# EAGLE design Soda_Popper (EAGLE 9.7.0)
AUTHOR: Hunter M., Kyle V., Ben B.; BOARD_NAME: Popper Board; DOC_NUM: 001; PROJECT_NAME: Soda Popper; REVISION: 0.0.1

## Sheet 1 of 4
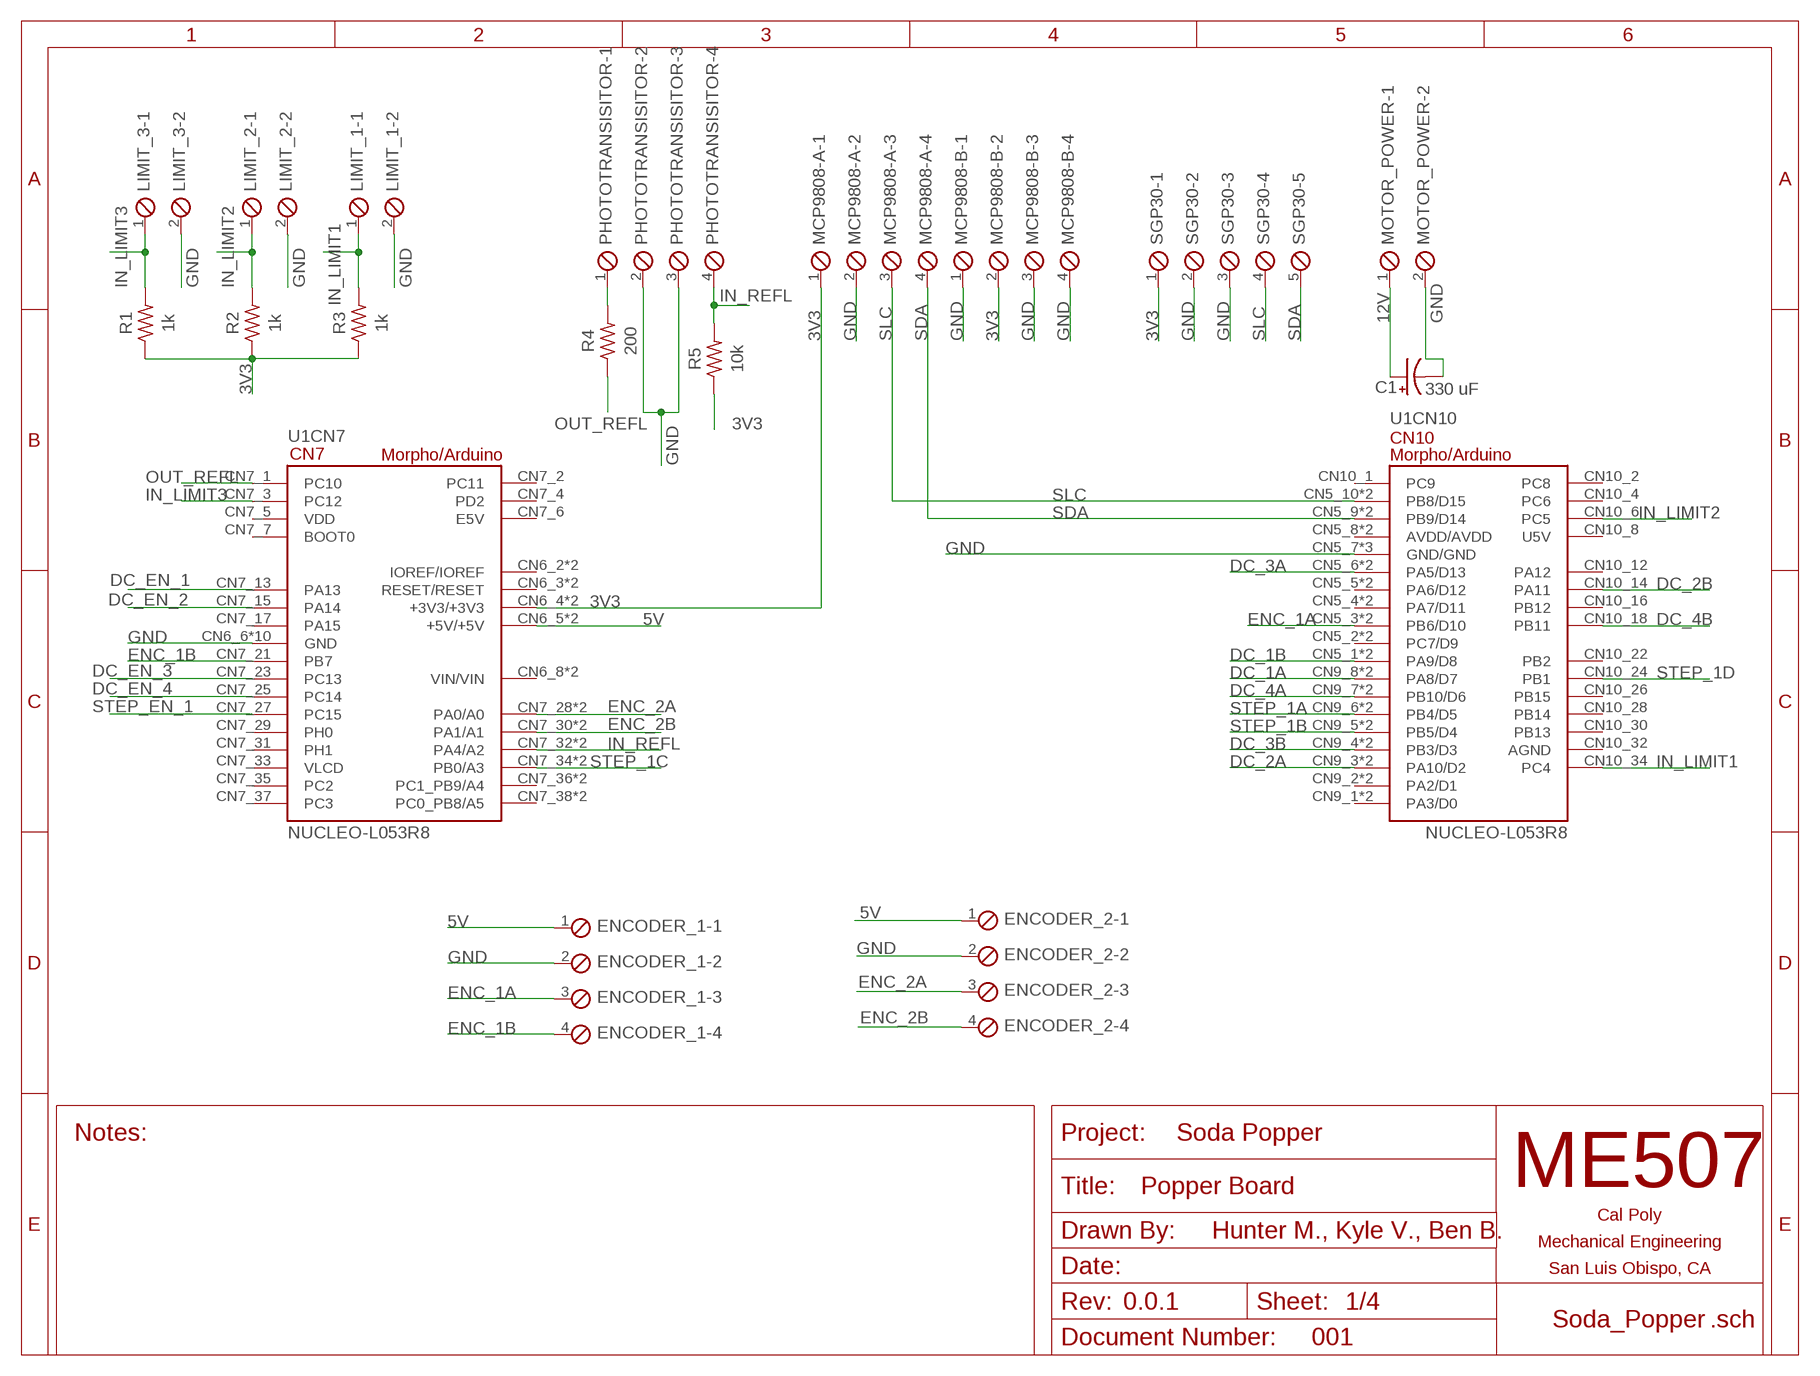
[diagram p0: schematic, sheet 1]

### Parts
C1  330 uF  C-POL-US_RADIAL-11MM-DIA  [CAPPRD508W65D1000H1100B]
ENCODER_1  SCREWTERM_4P_254  [4POL254]
ENCODER_2  SCREWTERM_4P_254  [4POL254]
LIMIT_1  SCREWTERM_2P_254  [2POL254]
LIMIT_2  SCREWTERM_2P_254  [2POL254]
LIMIT_3  SCREWTERM_2P_254  [2POL254]
MCP9808-A  SCREWTERM_4P_254  [4POL254]
MCP9808-B  SCREWTERM_4P_254  [4POL254]
MOTOR_POWER  SCREWTERM_2P_508  [2POL508]
PHOTOTRANSISITOR  SCREWTERM_4P_254  [4POL254]
R1  1k  R-US_CHIP-1206(3216-METRIC)  [RESC3216X70]
R2  1k  R-US_CHIP-1206(3216-METRIC)  [RESC3216X70]
R3  1k  R-US_CHIP-1206(3216-METRIC)  [RESC3216X70]
R4  200  R-US_CHIP-1206(3216-METRIC)  [RESC3216X70]
R5  10k  R-US_CHIP-0805(2012-METRIC)  [RESC2012X65]
SGP30  SCREWTERM_5P_254  [5POL254]
U1  NUCLEO-L053R8  [MODULE_NUCLEO-L053R8]

### Nets
3V3: MCP9808-A.1 MCP9808-B.2 R1.1 R2.1 R3.1 R5.1 SGP30.1 U1.CN6_4(CN7:+3V3/+3V3) U1.CN7_16(CN7:+3V3/+3V3)
5V: ENCODER_1.1 ENCODER_2.1 U1.CN6_5(CN7:+5V/+5V) U1.CN7_18(CN7:+5V/+5V) ; also sheet 2,3,4
12V: C1.1(+) MOTOR_POWER.1 ; also sheet 2,3,4
DC_1A: U1.CN9_8(CN10:PA8/D7) U1.CN10_23(CN10:PA8/D7) ; also sheet 2
DC_1B: U1.CN5_1(CN10:PA9/D8) U1.CN10_21(CN10:PA9/D8) ; also sheet 2
DC_2A: U1.CN9_3(CN10:PA10/D2) U1.CN10_33(CN10:PA10/D2) ; also sheet 2
DC_2B: U1.CN10_14(CN10:PA11) ; also sheet 2
DC_3A: U1.CN5_6(CN10:PA5/D13) U1.CN10_11(CN10:PA5/D13) ; also sheet 3
DC_3B: U1.CN9_4(CN10:PB3/D3) U1.CN10_31(CN10:PB3/D3) ; also sheet 3
DC_4A: U1.CN9_7(CN10:PB10/D6) U1.CN10_25(CN10:PB10/D6) ; also sheet 3
DC_4B: U1.CN10_18(CN10:PB11) ; also sheet 3
DC_EN_1: U1.CN7_13(CN7:PA13) ; also sheet 2
DC_EN_2: U1.CN7_15(CN7:PA14) ; also sheet 2
DC_EN_3: U1.CN7_23(CN7:PC13) ; also sheet 3
DC_EN_4: U1.CN7_25(CN7:PC14) ; also sheet 3
ENC_1A: ENCODER_1.3 U1.CN5_3(CN10:PB6/D10) U1.CN10_17(CN10:PB6/D10)
ENC_1B: ENCODER_1.4 U1.CN7_21(CN7:PB7)
ENC_2A: ENCODER_2.3 U1.CN7_28(CN7:PA0/A0) U1.CN8_1(CN7:PA0/A0)
ENC_2B: ENCODER_2.4 U1.CN7_30(CN7:PA1/A1) U1.CN8_2(CN7:PA1/A1)
GND: C1.2(-) ENCODER_1.2 ENCODER_2.2 LIMIT_1.2 LIMIT_2.2 LIMIT_3.2 MCP9808-A.2 MCP9808-B.1 MCP9808-B.3 MCP9808-B.4 MOTOR_POWER.2 PHOTOTRANSISITOR.2 PHOTOTRANSISITOR.3 SGP30.2 SGP30.3 U1.CN5_7(CN10:GND/GND) U1.CN6_6(CN7:GND) U1.CN6_7(CN7:GND) U1.CN7_8(CN7:GND) U1.CN7_19(CN7:GND) U1.CN7_20(CN7:GND) U1.CN7_22(CN7:GND) U1.CN10_9(CN10:GND/GND) U1.CN10_20(CN10:GND/GND) U1.CN11_1(CN7:GND) U1.CN11_2(CN7:GND) U1.CN12_1(CN7:GND) U1.CN12_2(CN7:GND) ; also sheet 2,3,4
IN_LIMIT1: LIMIT_1.1 R3.2 U1.CN10_34(CN10:PC4)
IN_LIMIT2: LIMIT_2.1 R2.2 U1.CN10_6(CN10:PC5)
IN_LIMIT3: LIMIT_3.1 R1.2 U1.CN7_3(CN7:PC12)
IN_REFL: PHOTOTRANSISITOR.4 R5.2 U1.CN7_32(CN7:PA4/A2) U1.CN8_3(CN7:PA4/A2)
N$1: PHOTOTRANSISITOR.1 R4.2
OUT_REFL: R4.1 U1.CN7_1(CN7:PC10)
SDA: MCP9808-A.4 SGP30.5 U1.CN5_9(CN10:PB9/D14) U1.CN10_5(CN10:PB9/D14)
SLC: MCP9808-A.3 SGP30.4 U1.CN5_10(CN10:PB8/D15) U1.CN10_3(CN10:PB8/D15)
STEP_1A: U1.CN9_6(CN10:PB4/D5) U1.CN10_27(CN10:PB4/D5) ; also sheet 4
STEP_1B: U1.CN9_5(CN10:PB5/D4) U1.CN10_29(CN10:PB5/D4) ; also sheet 4
STEP_1C: U1.CN7_34(CN7:PB0/A3) U1.CN8_4(CN7:PB0/A3) ; also sheet 4
STEP_1D: U1.CN10_24(CN10:PB1) ; also sheet 4
STEP_EN_1: U1.CN7_27(CN7:PC15) ; also sheet 4
Unconnected: U1.CN5_2(CN10:PC7/D9) U1.CN5_4(CN10:PA7/D11) U1.CN5_5(CN10:PA6/D12) U1.CN5_8(CN10:AVDD/AVDD) U1.CN6_2(CN7:IOREF/IOREF) U1.CN6_3(CN7:RESET/RESET) U1.CN6_8(CN7:VIN/VIN) U1.CN7_2(CN7:PC11) U1.CN7_4(CN7:PD2) U1.CN7_5(CN7:VDD) U1.CN7_6(CN7:E5V) U1.CN7_7(CN7:BOOT0) U1.CN7_12(CN7:IOREF/IOREF) U1.CN7_14(CN7:RESET/RESET) U1.CN7_17(CN7:PA15) U1.CN7_24(CN7:VIN/VIN) U1.CN7_29(CN7:PH0) U1.CN7_31(CN7:PH1) U1.CN7_33(CN7:VLCD) U1.CN7_35(CN7:PC2) U1.CN7_36(CN7:PC1_PB9/A4) U1.CN7_37(CN7:PC3) U1.CN7_38(CN7:PC0_PB8/A5) U1.CN8_5(CN7:PC1_PB9/A4) U1.CN8_6(CN7:PC0_PB8/A5) U1.CN9_1(CN10:PA3/D0) U1.CN9_2(CN10:PA2/D1) U1.CN10_1(CN10:PC9) U1.CN10_2(CN10:PC8) U1.CN10_4(CN10:PC6) U1.CN10_7(CN10:AVDD/AVDD) U1.CN10_8(CN10:U5V) U1.CN10_12(CN10:PA12) U1.CN10_13(CN10:PA6/D12) U1.CN10_15(CN10:PA7/D11) U1.CN10_16(CN10:PB12) U1.CN10_19(CN10:PC7/D9) U1.CN10_22(CN10:PB2) U1.CN10_26(CN10:PB15) U1.CN10_28(CN10:PB14) U1.CN10_30(CN10:PB13) U1.CN10_32(CN10:AGND) U1.CN10_35(CN10:PA2/D1) U1.CN10_37(CN10:PA3/D0)

## Sheet 2 of 4
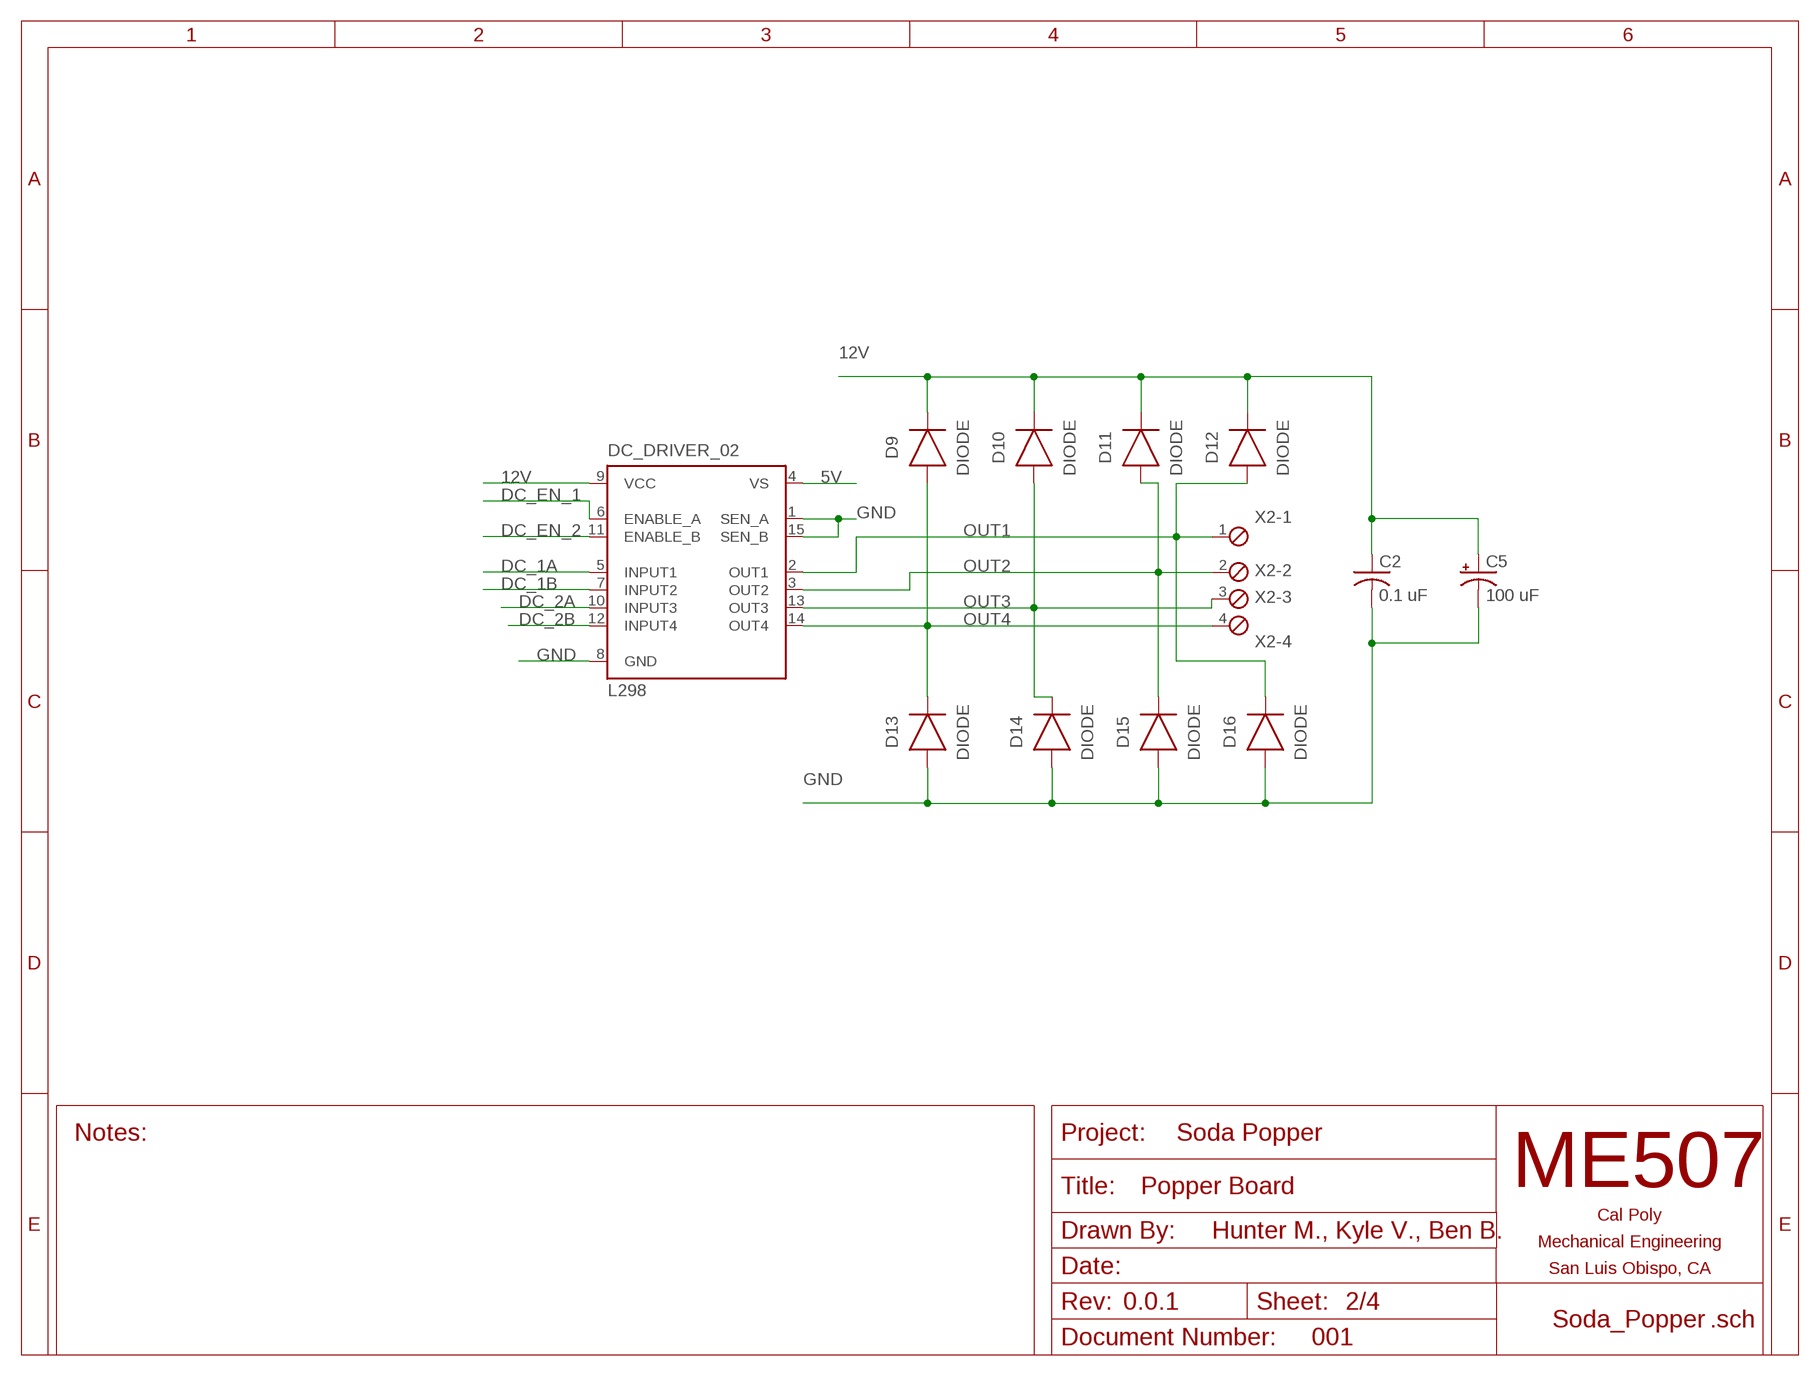
[diagram p1: schematic, sheet 2]

### Parts
C2  0.1 uF  C-US_CHIP-0805(2012-METRIC)  [CAPC2012X110]
C5  100 uF  C-POL-US_RADIAL-11MM-DIA  [CAPPRD508W65D1000H1100B]
D9  DIODE  DIODEDO-214AA(SMB)  [DIOM5336X265N]
D10  DIODE  DIODEDO-214AA(SMB)  [DIOM5336X265N]
D11  DIODE  DIODEDO-214AA(SMB)  [DIOM5336X265N]
D12  DIODE  DIODEDO-214AA(SMB)  [DIOM5336X265N]
D13  DIODE  DIODEDO-214AA(SMB)  [DIOM5336X265N]
D14  DIODE  DIODEDO-214AA(SMB)  [DIOM5336X265N]
D15  DIODE  DIODEDO-214AA(SMB)  [DIOM5336X265N]
D16  DIODE  DIODEDO-214AA(SMB)  [DIOM5336X265N]
DC_DRIVER_02  L298  [MULTIWATT-15]
X2  SCREWTERM_4P_508  [4POL508]

### Nets
5V: DC_DRIVER_02.4(VS) ; also sheet 1,3,4
12V: C2.1 C5.1(+) D9.1(C) D10.1(C) D11.1(C) D12.1(C) DC_DRIVER_02.9(VCC) ; also sheet 1,3,4
DC_1A: DC_DRIVER_02.5(INPUT1) ; also sheet 1
DC_1B: DC_DRIVER_02.7(INPUT2) ; also sheet 1
DC_2A: DC_DRIVER_02.10(INPUT3) ; also sheet 1
DC_2B: DC_DRIVER_02.12(INPUT4) ; also sheet 1
DC_EN_1: DC_DRIVER_02.6(ENABLE_A) ; also sheet 1
DC_EN_2: DC_DRIVER_02.11(ENABLE_B) ; also sheet 1
GND: C2.2 C5.2(-) D13.2(A) D14.2(A) D15.2(A) D16.2(A) DC_DRIVER_02.1(SEN_A) DC_DRIVER_02.8(GND) DC_DRIVER_02.15(SEN_B) ; also sheet 1,3,4
OUT1: D12.2(A) D16.1(C) DC_DRIVER_02.2(OUT1) X2.1
OUT2: D11.2(A) D15.1(C) DC_DRIVER_02.3(OUT2) X2.2
OUT3: D10.2(A) D14.1(C) DC_DRIVER_02.13(OUT3) X2.3
OUT4: D9.2(A) D13.1(C) DC_DRIVER_02.14(OUT4) X2.4

## Sheet 3 of 4
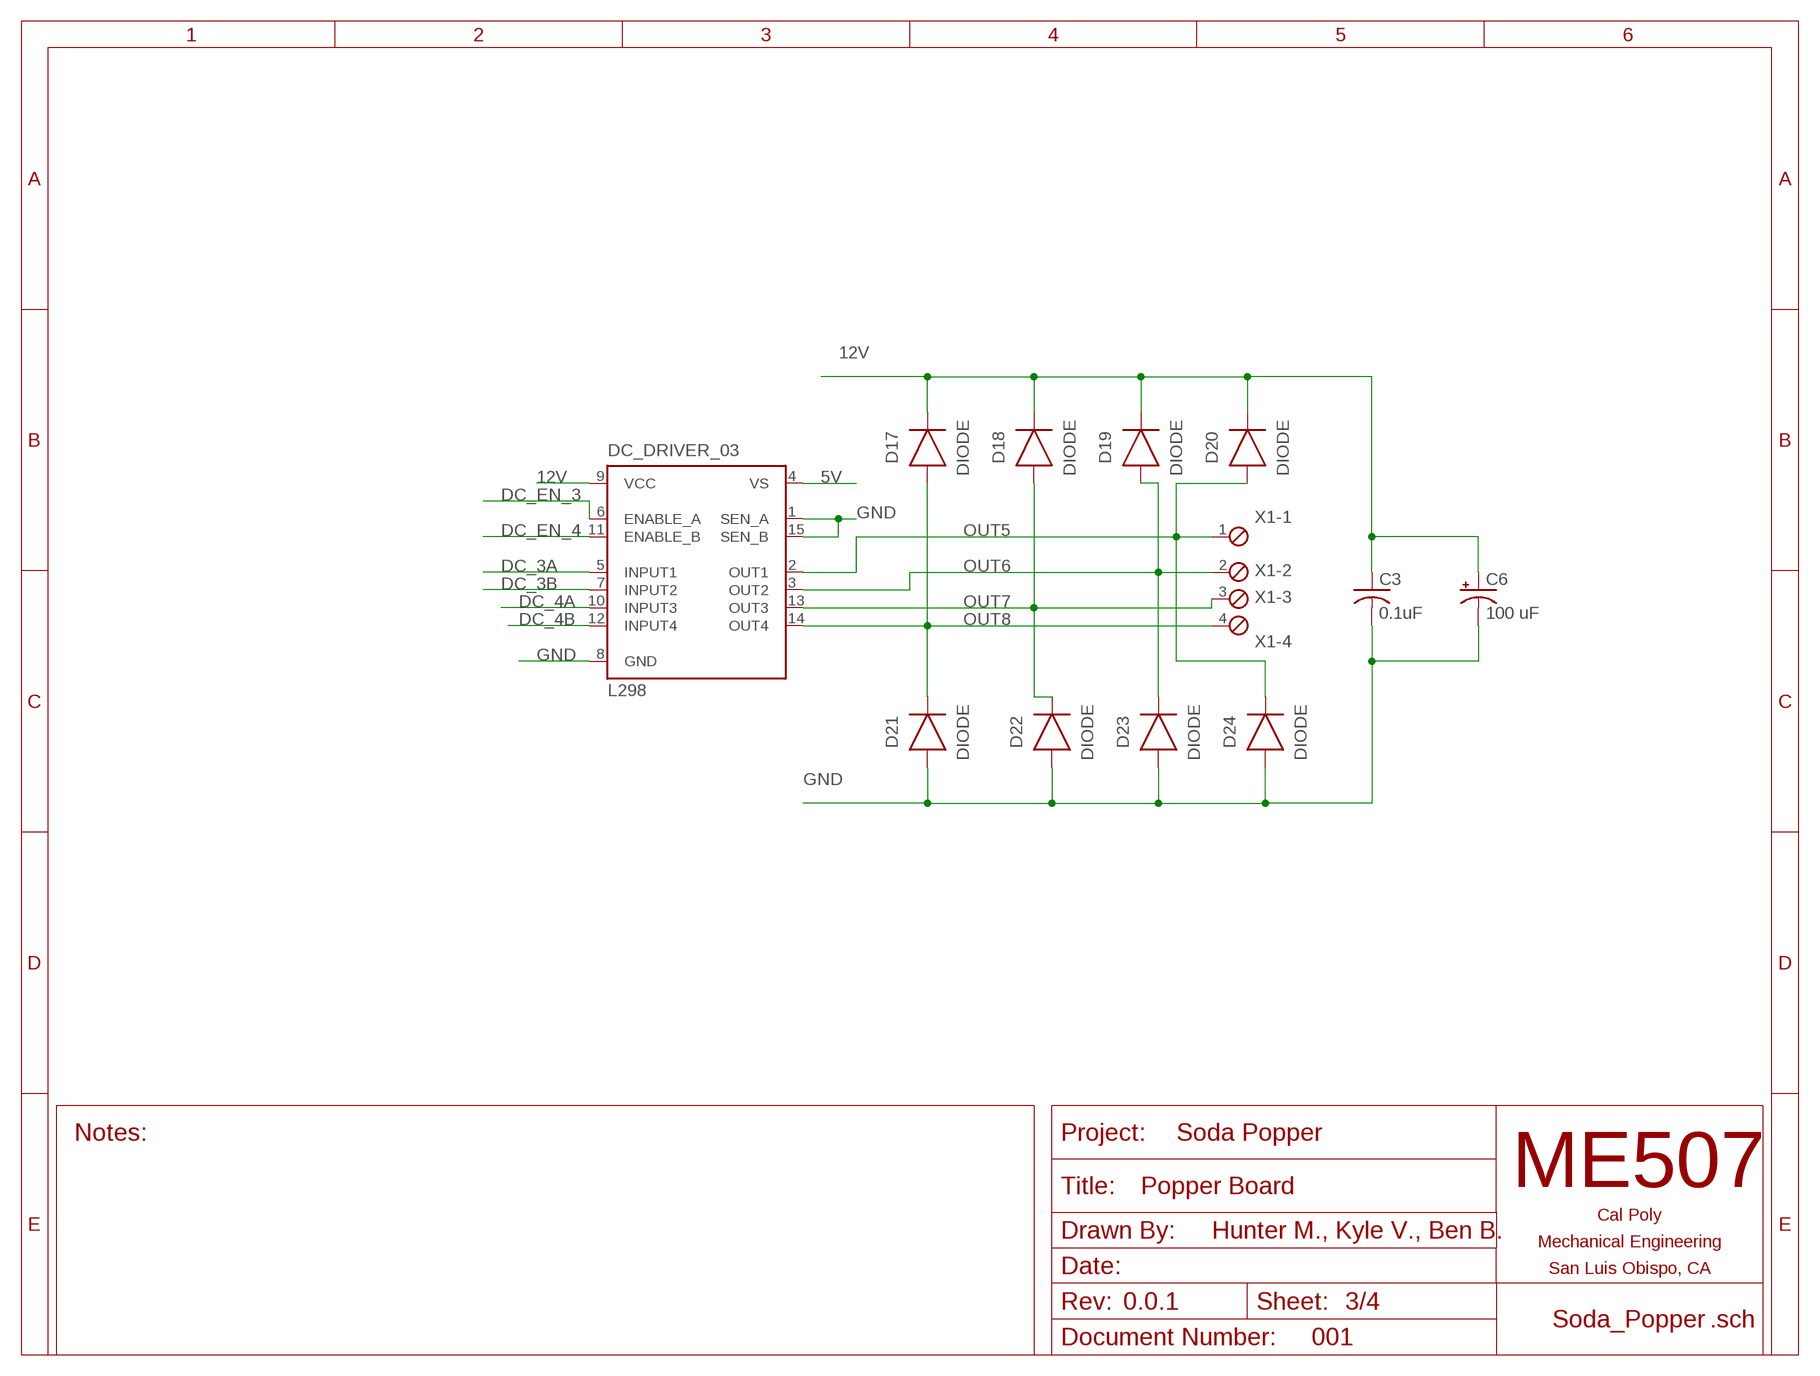
[diagram p2: schematic, sheet 3]

### Parts
C3  0.1uF  C-US_CHIP-0805(2012-METRIC)  [CAPC2012X110]
C6  100 uF  C-POL-US_RADIAL-11MM-DIA  [CAPPRD508W65D1000H1100B]
D17  DIODE  DIODEDO-214AA(SMB)  [DIOM5336X265N]
D18  DIODE  DIODEDO-214AA(SMB)  [DIOM5336X265N]
D19  DIODE  DIODEDO-214AA(SMB)  [DIOM5336X265N]
D20  DIODE  DIODEDO-214AA(SMB)  [DIOM5336X265N]
D21  DIODE  DIODEDO-214AA(SMB)  [DIOM5336X265N]
D22  DIODE  DIODEDO-214AA(SMB)  [DIOM5336X265N]
D23  DIODE  DIODEDO-214AA(SMB)  [DIOM5336X265N]
D24  DIODE  DIODEDO-214AA(SMB)  [DIOM5336X265N]
DC_DRIVER_03  L298  [MULTIWATT-15]
X1  SCREWTERM_4P_508  [4POL508]

### Nets
5V: DC_DRIVER_03.4(VS) ; also sheet 1,2,4
12V: C3.1 C6.1(+) D17.1(C) D18.1(C) D19.1(C) D20.1(C) DC_DRIVER_03.9(VCC) ; also sheet 1,2,4
DC_3A: DC_DRIVER_03.5(INPUT1) ; also sheet 1
DC_3B: DC_DRIVER_03.7(INPUT2) ; also sheet 1
DC_4A: DC_DRIVER_03.10(INPUT3) ; also sheet 1
DC_4B: DC_DRIVER_03.12(INPUT4) ; also sheet 1
DC_EN_3: DC_DRIVER_03.6(ENABLE_A) ; also sheet 1
DC_EN_4: DC_DRIVER_03.11(ENABLE_B) ; also sheet 1
GND: C3.2 C6.2(-) D21.2(A) D22.2(A) D23.2(A) D24.2(A) DC_DRIVER_03.1(SEN_A) DC_DRIVER_03.8(GND) DC_DRIVER_03.15(SEN_B) ; also sheet 1,2,4
OUT5: D20.2(A) D24.1(C) DC_DRIVER_03.2(OUT1) X1.1
OUT6: D19.2(A) D23.1(C) DC_DRIVER_03.3(OUT2) X1.2
OUT7: D18.2(A) D22.1(C) DC_DRIVER_03.13(OUT3) X1.3
OUT8: D17.2(A) D21.1(C) DC_DRIVER_03.14(OUT4) X1.4

## Sheet 4 of 4
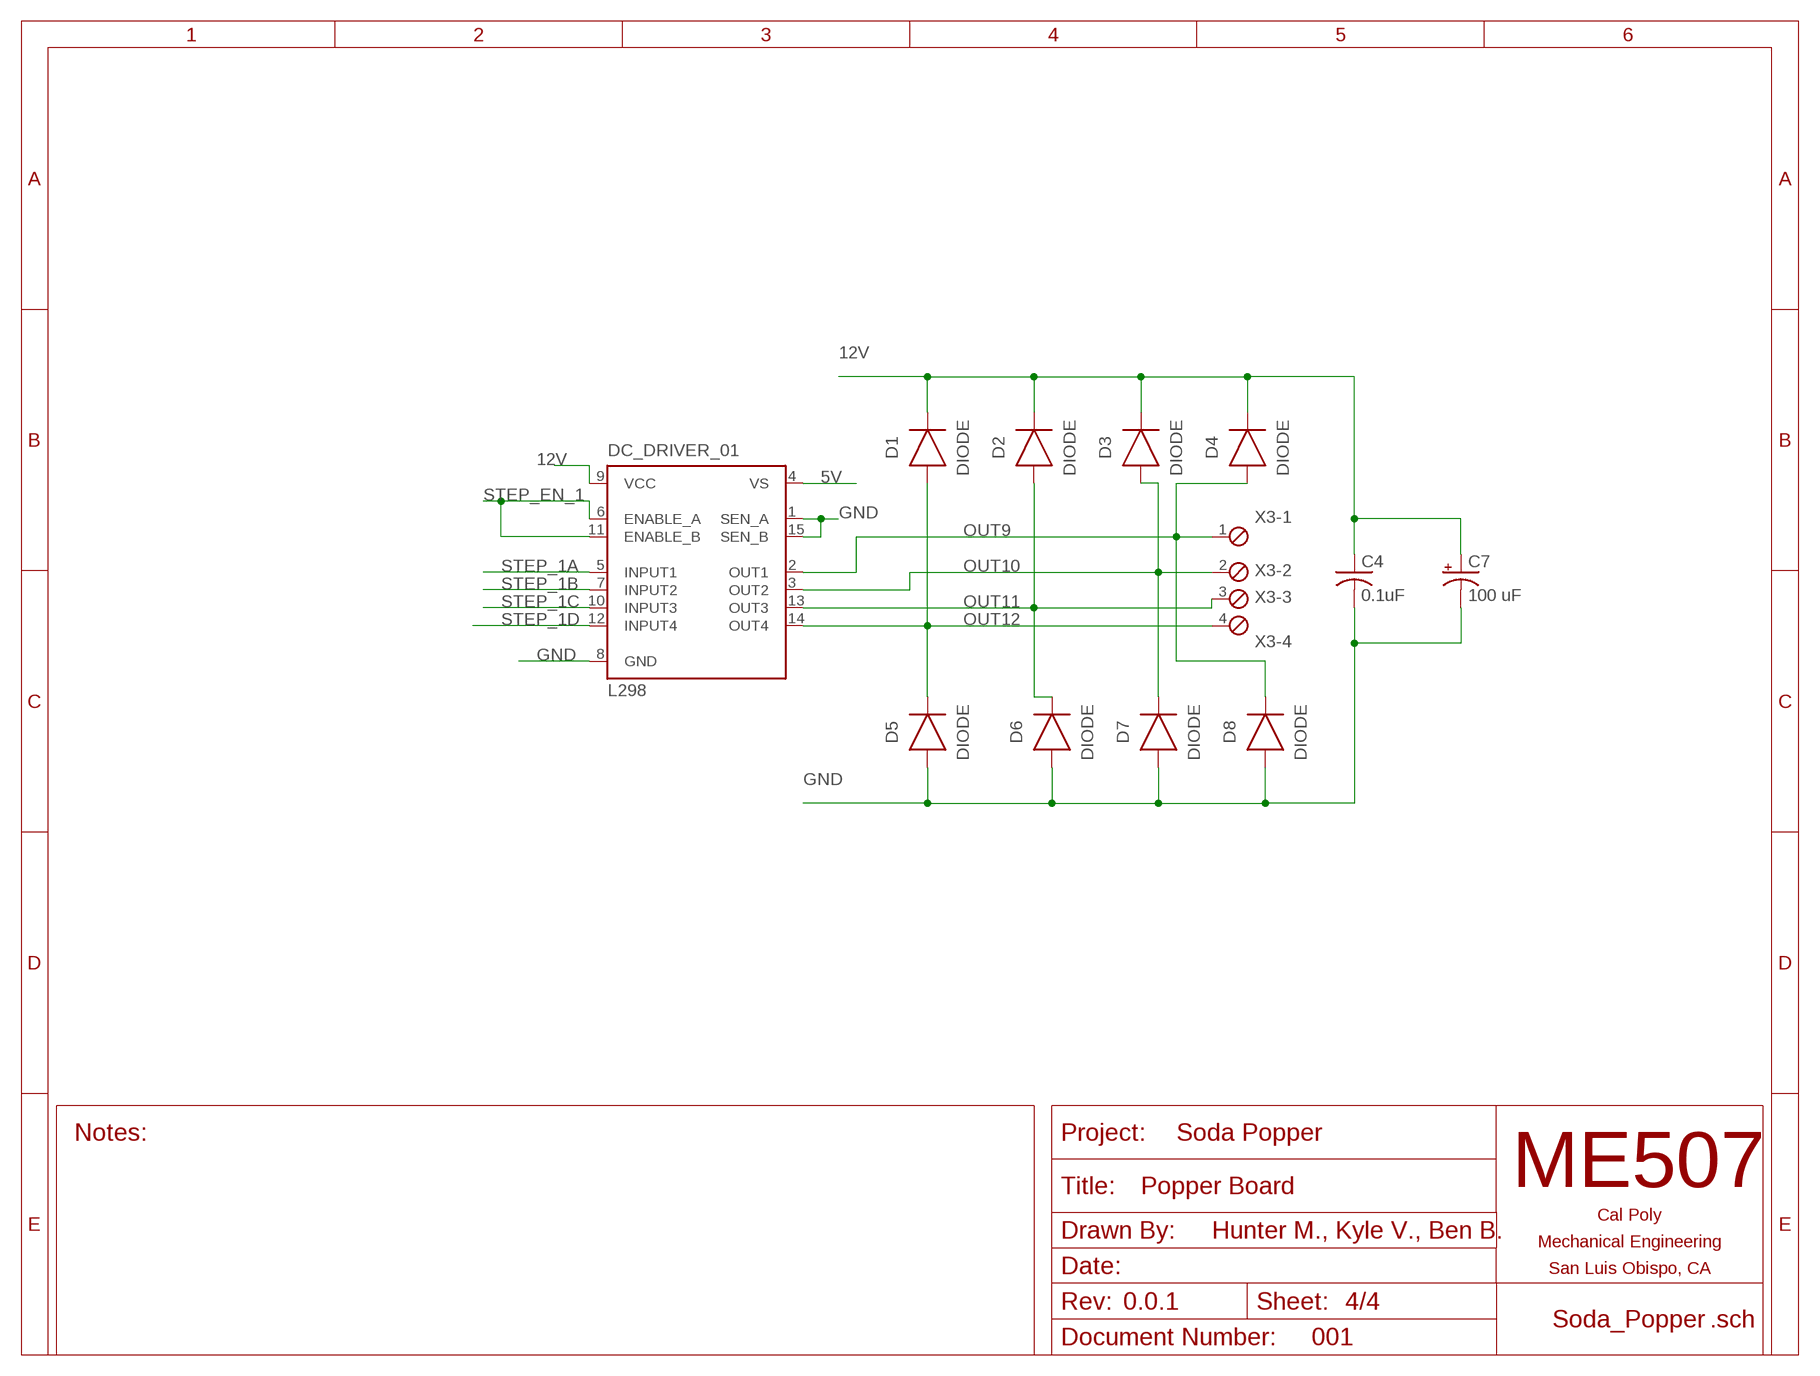
[diagram p3: schematic, sheet 4]

### Parts
C4  0.1uF  C-US_CHIP-0805(2012-METRIC)  [CAPC2012X110]
C7  100 uF  C-POL-US_RADIAL-11MM-DIA  [CAPPRD508W65D1000H1100B]
D1  DIODE  DIODEDO-214AA(SMB)  [DIOM5336X265N]
D2  DIODE  DIODEDO-214AA(SMB)  [DIOM5336X265N]
D3  DIODE  DIODEDO-214AA(SMB)  [DIOM5336X265N]
D4  DIODE  DIODEDO-214AA(SMB)  [DIOM5336X265N]
D5  DIODE  DIODEDO-214AA(SMB)  [DIOM5336X265N]
D6  DIODE  DIODEDO-214AA(SMB)  [DIOM5336X265N]
D7  DIODE  DIODEDO-214AA(SMB)  [DIOM5336X265N]
D8  DIODE  DIODEDO-214AA(SMB)  [DIOM5336X265N]
DC_DRIVER_01  L298  [MULTIWATT-15]
X3  SCREWTERM_4P_508  [4POL508]

### Nets
5V: DC_DRIVER_01.4(VS) ; also sheet 1,2,3
12V: C4.1 C7.1(+) D1.1(C) D2.1(C) D3.1(C) D4.1(C) DC_DRIVER_01.9(VCC) ; also sheet 1,2,3
GND: C4.2 C7.2(-) D5.2(A) D6.2(A) D7.2(A) D8.2(A) DC_DRIVER_01.1(SEN_A) DC_DRIVER_01.8(GND) DC_DRIVER_01.15(SEN_B) ; also sheet 1,2,3
OUT9: D4.2(A) D8.1(C) DC_DRIVER_01.2(OUT1) X3.1
OUT10: D3.2(A) D7.1(C) DC_DRIVER_01.3(OUT2) X3.2
OUT11: D2.2(A) D6.1(C) DC_DRIVER_01.13(OUT3) X3.3
OUT12: D1.2(A) D5.1(C) DC_DRIVER_01.14(OUT4) X3.4
STEP_1A: DC_DRIVER_01.5(INPUT1) ; also sheet 1
STEP_1B: DC_DRIVER_01.7(INPUT2) ; also sheet 1
STEP_1C: DC_DRIVER_01.10(INPUT3) ; also sheet 1
STEP_1D: DC_DRIVER_01.12(INPUT4) ; also sheet 1
STEP_EN_1: DC_DRIVER_01.6(ENABLE_A) DC_DRIVER_01.11(ENABLE_B) ; also sheet 1

## Library data of the parts
C1 C5-C7 = Capacitor:C-POL-US: Capacitor Polarised - ANSI; CATEGORY: Capacitor
C2-C4 = Capacitor:C-US: Capacitor - ANSI; CATEGORY: Capacitor
D1-D24 = Diode:DIODE: Diode Rectifier - Generic; CATEGORY: Diode; SUB-CATEGORY: Rectifier
DC_DRIVER_01-DC_DRIVER_03 = st-microelectronics:L298: DUAL FULL-BRIDGE DRIVER; MPN: L298N; OC_FARNELL: 1589425; OC_NEWARK: 32M1527
ENCODER_1 ENCODER_2 MCP9808-A MCP9808-B PHOTOTRANSISITOR X1-X3 = ME507:SCREWTERM_4P: Screw Terminal Block This part is designed for a screw terminal connector. The 2.54mm (0.100 inch) foorprint can also be used for male or female pin headers such as those on most development boards. One can also solder wires directly into the holes, though this makes modifications or repairs to the system more inconvenient. Larger versions can carry more current.
LIMIT_1-LIMIT_3 MOTOR_POWER = ME507:SCREWTERM_2P: Screw Terminal Block This part is designed for a screw terminal connector. The 2.54mm (0.100 inch) foorprint can also be used for male or female pin headers such as those on most development boards. One can also solder wires directly into the holes, though this makes modifications or repairs to the system more inconvenient. Larger versions can carry more current.
R1-R5 = Resistor:R-US: Resistor Fixed - ANSI; CATEGORY: Resistor; SUB-CATEGORY: Fixed
SGP30 = ME507:SCREWTERM_5P: Screw Terminal Block This part is designed for a screw terminal connector. The 2.54mm (0.100 inch) foorprint can also be used for male or female pin headers such as those on most development boards. One can also solder wires directly into the holes, though this makes modifications or repairs to the system more inconvenient. Larger versions can carry more current.
U1 = NUCLEO-L053R8:NUCLEO-L053R8: STM32 Nucleo-64 development board with STM32L053R8T6 MCU, supports Arduino and ST morpho connectivity Check prices <https://pricing.snapeda.com/parts/NUCLEO-L053R8/STMicroelectronics/view-part?ref=eda>; AVAILABILITY: In Stock; DESCRIPTION: STM32L053R8, mbed-Enabled Development Nucleo-64 STM32L0 ARM® Cortex®-M0+ MCU 32-Bit Embedded Evaluation Board; MF: STMicroelectronics; MP: NUCLEO-L053R8; PACKAGE: None; PRICE: None; PURCHASE-URL: https://pricing.snapeda.com/search/part/NUCLEO-L053R8/?ref=eda

## Board
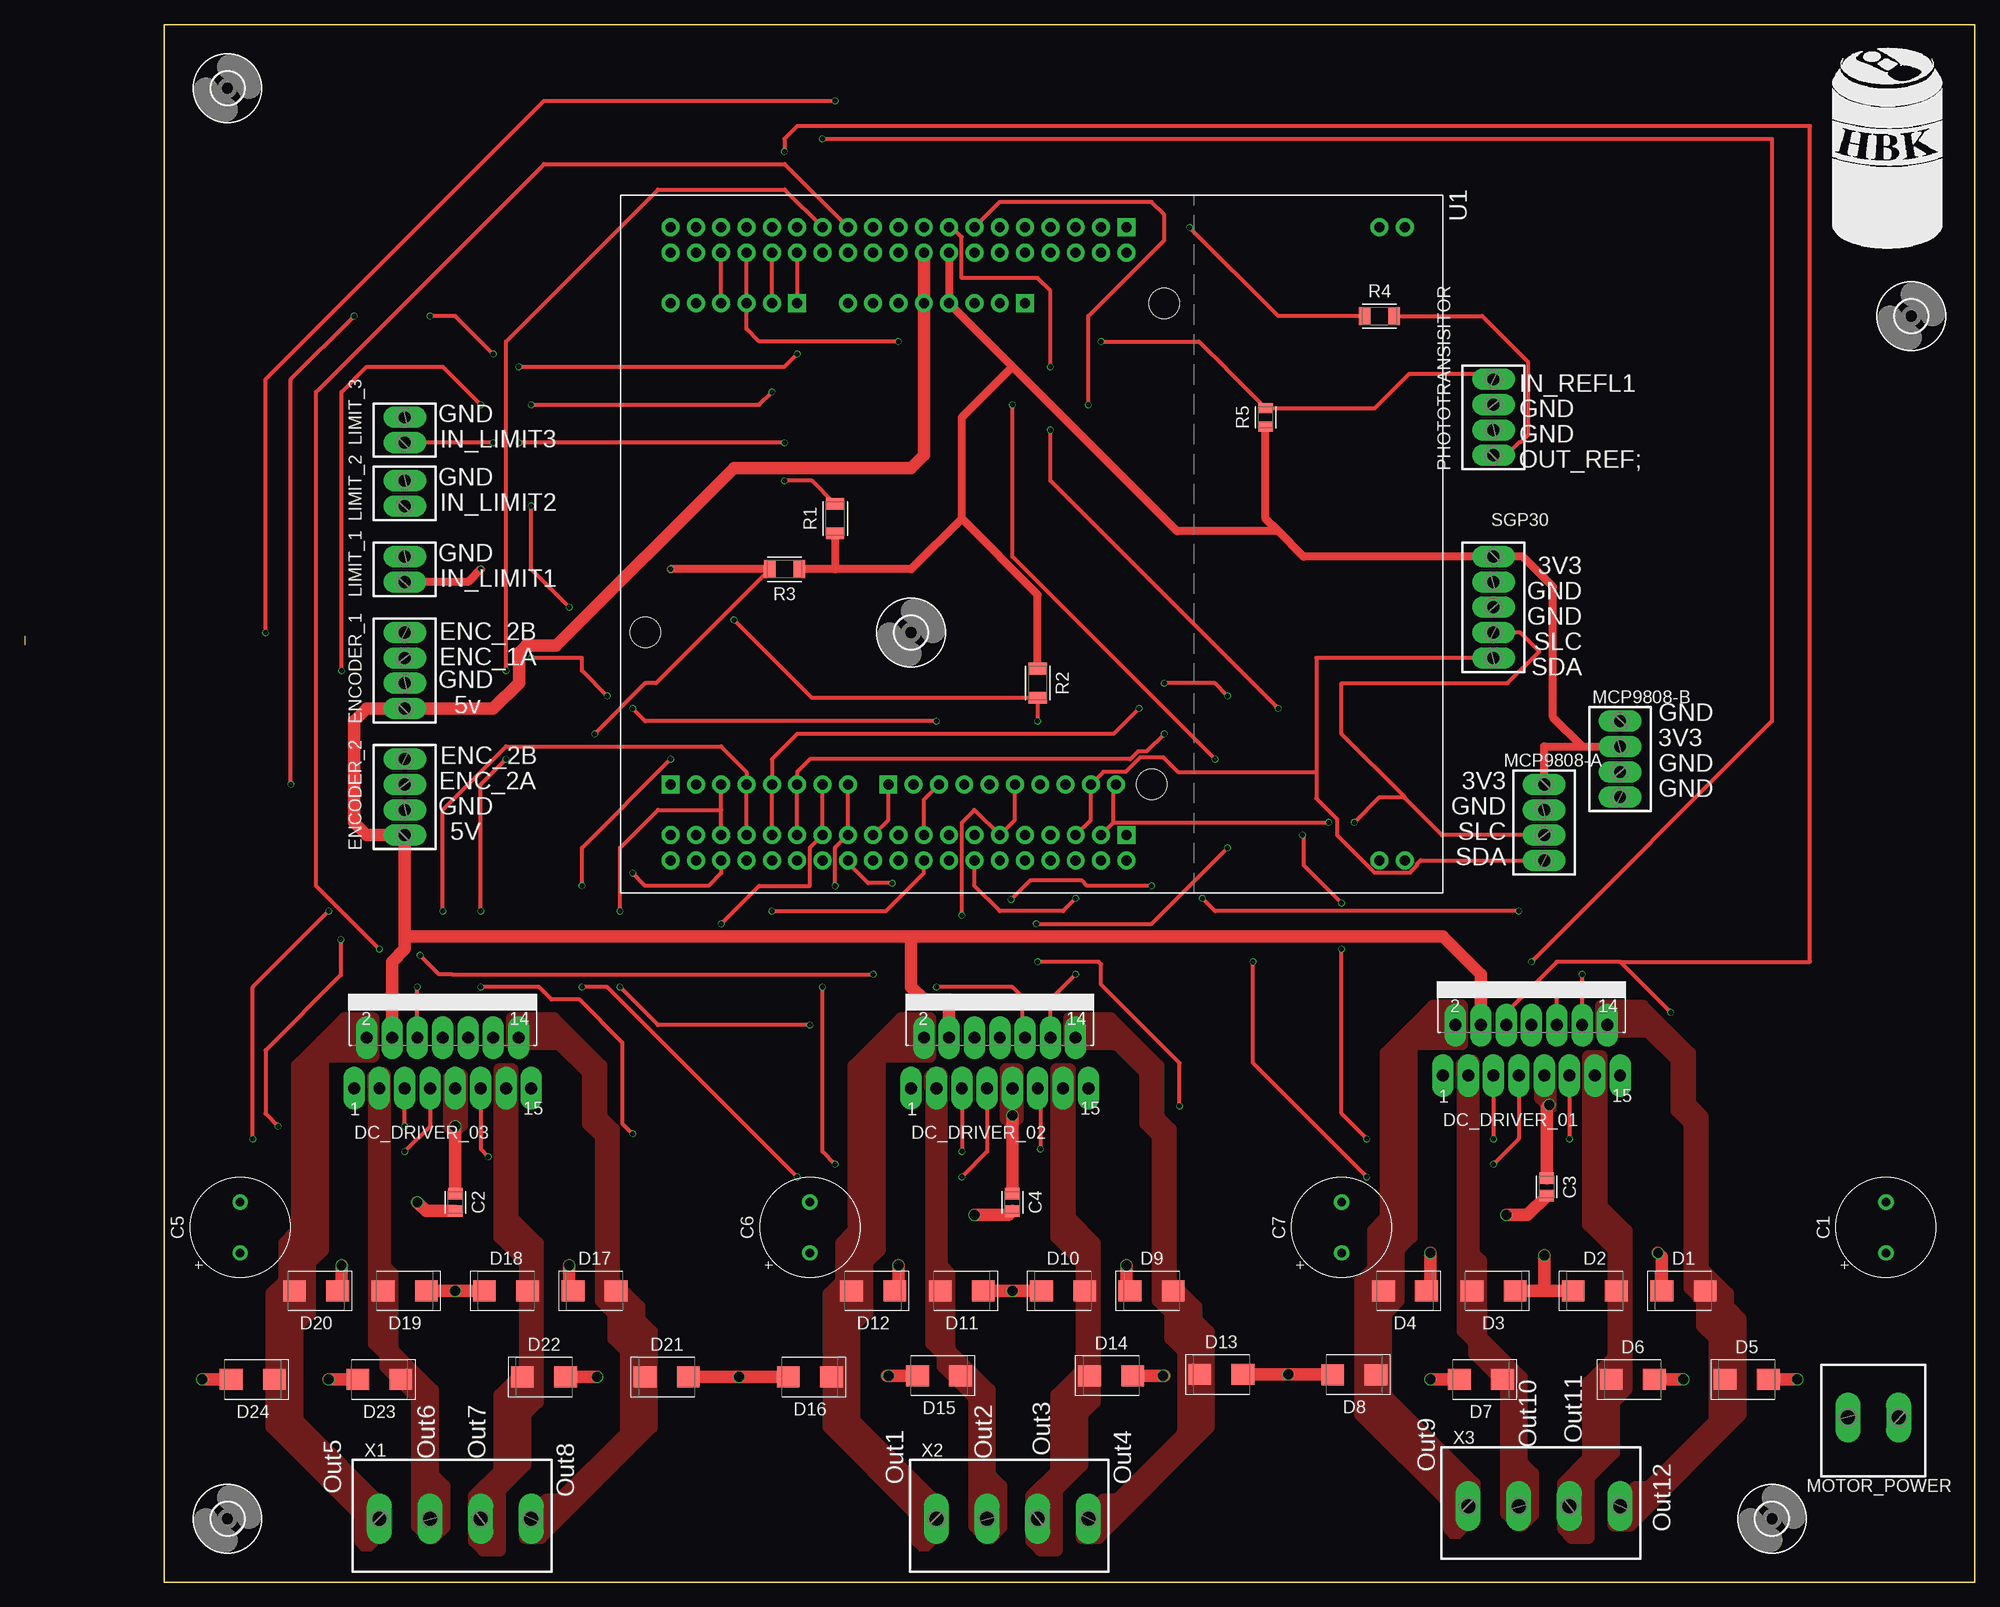
[diagram p4: board, top side]
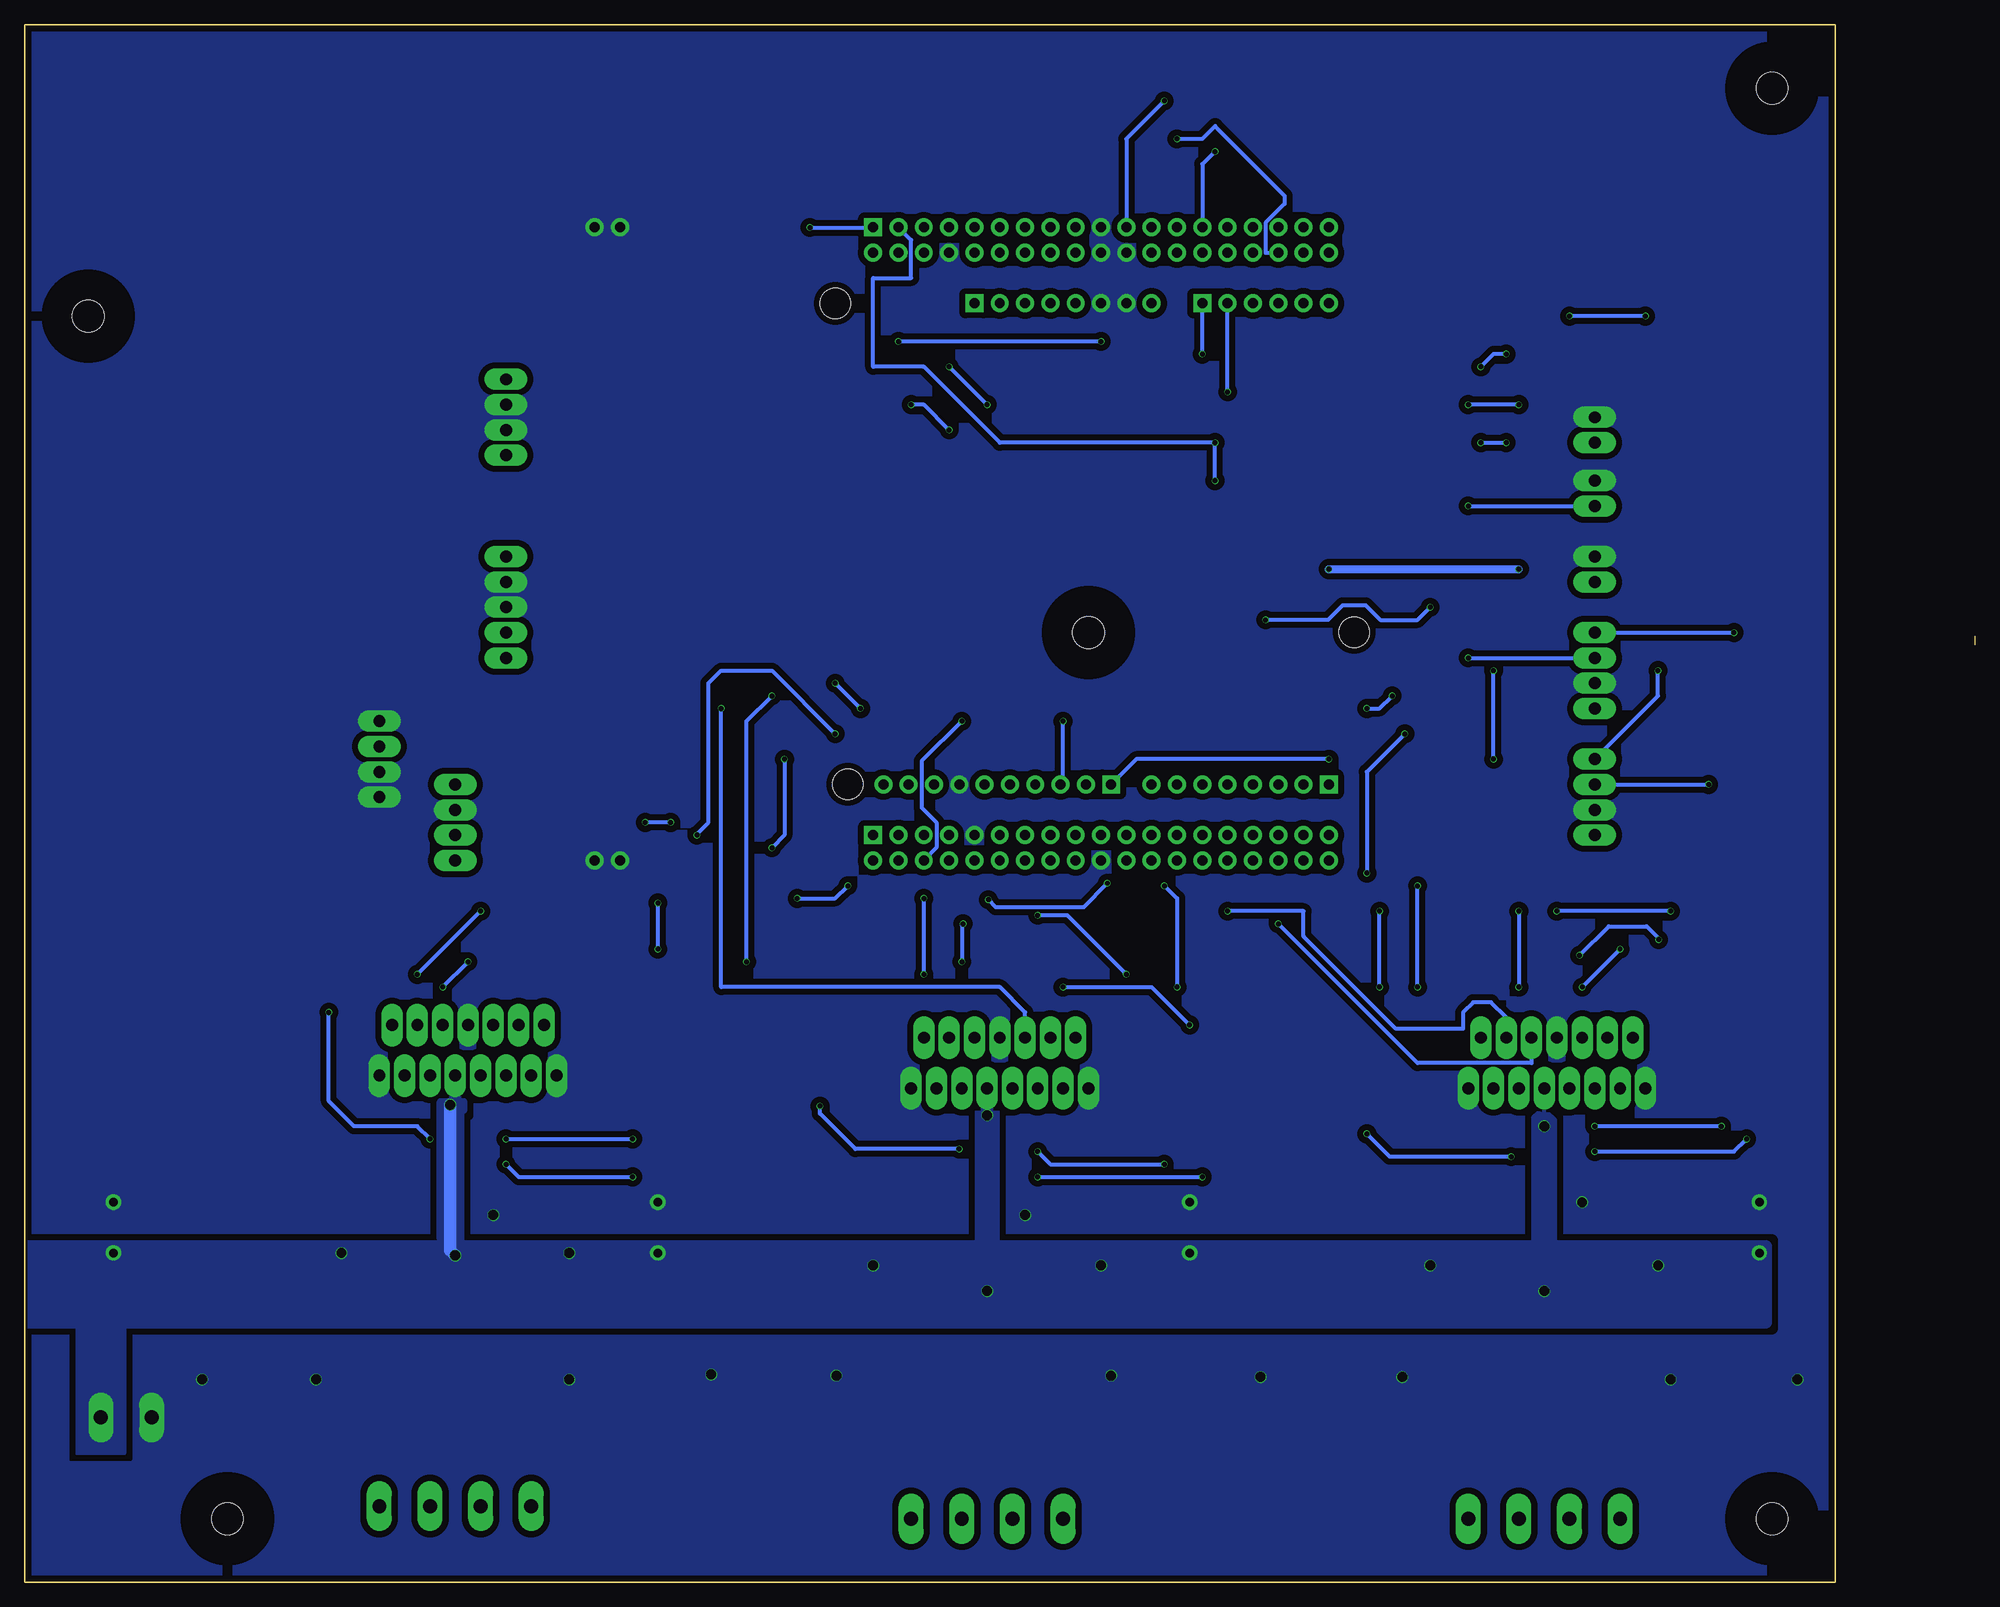
[diagram p5: board, bottom side, seen from below]

Size 195.58 x 156.21 mm. Coordinates in mm from the lower left corner, seen from the top.
Outline: 0,94.92 0,93.98
Outline: 13.97,0 195.58,0 195.58,156.21 13.97,156.21 13.97,0
Copper layers (1*16): Top 0.035mm / dielectric 1.6mm / Bottom 0.035mm
Design rules "default *": minimum track width 5mil, minimum drill 0.3mm, track to track 5mil, track to pad 5mil, pad to pad 5mil, via to via 5mil, smd to smd 5mil, copper to edge 0.2mm, drill to drill 6mil, minimum pad ring 10mil, minimum via ring 3mil, stop-mask expansion 4mil, vias tented up to drill 0mil, thermal gap 10mil
Holes 0.35 mm at 309.88,176.53 236.22,43.18

### Footprints (pad centres in the part's own frame; a part is rotated, then mirrored left to right if it is on the bottom)
CAPPRD508W65D1000H1100B = drill 0.85 pad 1.45: 1 -2.54,0; 2 2.54,0
CAPC2012X110 = smd 1.165 x 1.465: 1 -0.875,0; 2 0.875,0
DIOM5336X265N = smd 2.284 x 2.124: 1 -2.164,0; 2 2.164,0
MULTIWATT-15 = drill 1.2 long: 1 -8.89,-7.62; 2 -7.62,-2.54; 3 -6.35,-7.62; 4 -5.08,-2.54; 5 -3.81,-7.62; 6 -2.54,-2.54; 7 -1.27,-7.62; 8 0,-2.54; 9 1.27,-7.62; 10 2.54,-2.54; 11 3.81,-7.62; 12 5.08,-2.54; 13 6.35,-7.62; 14 7.62,-2.54; 15 8.89,-7.62
4POL254 = drill 1.2 long: 1 -3.81,0; 2 -1.27,0; 3 1.27,0; 4 3.81,0
2POL254 = drill 1.2 long: 1 -1.27,0; 2 1.27,0
2POL508 = drill 1.4 long: 1 -2.54,0; 2 2.54,0
RESC3216X70 = smd 1.165 x 1.815: 1 -1.475,0; 2 1.475,0
RESC2012X65 = smd 1.031 x 1.42: 1 -0.919,0; 2 0.919,0
5POL254 = drill 1.2 long: 1 -5.08,0; 2 -2.54,0; 3 0,0; 4 2.54,0; 5 5.08,0
MODULE_NUCLEO-L053R8 = drill 1 square: CN5_1 24.13,-14.37; CN6_1 -24.13,-0.65; CN7_1 -31.75,9.51; CN8_1 -24.13,-23.51; CN9_1 24.13,-36.21; CN10_1 29.21,9.51 | drill 1: CN5_2 24.13,-11.83; CN5_3 24.13,-9.29; CN5_4 24.13,-6.75; CN5_5 24.13,-4.21; CN5_6 24.13,-1.67; CN5_7 24.13,0.87; CN5_8 24.13,3.41; CN5_9 24.13,5.95; CN5_10 24.13,8.49; CN6_2 -24.13,-3.19; CN6_3 -24.13,-5.73; CN6_4 -24.13,-8.27; CN6_5 -24.13,-10.81; CN6_6 -24.13,-13.35; CN6_7 -24.13,-15.89; CN6_8 -24.13,-18.43; CN7_2 -29.21,9.51; CN7_3 -31.75,6.97; CN7_4 -29.21,6.97; CN7_5 -31.75,4.43; CN7_6 -29.21,4.43; CN7_7 -31.75,1.89; CN7_8 -29.21,1.89; CN7_9 -31.75,-0.65; CN7_10 -29.21,-0.65; CN7_11 -31.75,-3.19; CN7_12 -29.21,-3.19; CN7_13 -31.75,-5.73; CN7_14 -29.21,-5.73; CN7_15 -31.75,-8.27; CN7_16 -29.21,-8.27; CN7_17 -31.75,-10.81; CN7_18 -29.21,-10.81; CN7_19 -31.75,-13.35; CN7_20 -29.21,-13.35; CN7_21 -31.75,-15.89; CN7_22 -29.21,-15.89; CN7_23 -31.75,-18.43; CN7_24 -29.21,-18.43; CN7_25 -31.75,-20.97; CN7_26 -29.21,-20.97; CN7_27 -31.75,-23.51; CN7_28 -29.21,-23.51; CN7_29 -31.75,-26.05; CN7_30 -29.21,-26.05; CN7_31 -31.75,-28.59; CN7_32 -29.21,-28.59; CN7_33 -31.75,-31.13; CN7_34 -29.21,-31.13; CN7_35 -31.75,-33.67; CN7_36 -29.21,-33.67; CN7_37 -31.75,-36.21; CN7_38 -29.21,-36.21; CN8_2 -24.13,-26.05; CN8_3 -24.13,-28.59; CN8_4 -24.13,-31.13; CN8_5 -24.13,-33.67; CN8_6 -24.13,-36.21; CN9_2 24.13,-33.67; CN9_3 24.13,-31.13; CN9_4 24.13,-28.59; CN9_5 24.13,-26.05; CN9_6 24.13,-23.51; CN9_7 24.13,-20.97; CN9_8 24.13,-18.43; CN10_2 31.75,9.51; CN10_3 29.21,6.97; CN10_4 31.75,6.97; CN10_5 29.21,4.43; CN10_6 31.75,4.43; CN10_7 29.21,1.89; CN10_8 31.75,1.89; CN10_9 29.21,-0.65; CN10_10 31.75,-0.65; CN10_11 29.21,-3.19; CN10_12 31.75,-3.19; CN10_13 29.21,-5.73; CN10_14 31.75,-5.73; CN10_15 29.21,-8.27; CN10_16 31.75,-8.27; CN10_17 29.21,-10.81; CN10_18 31.75,-10.81; CN10_19 29.21,-13.35; CN10_20 31.75,-13.35; CN10_21 29.21,-15.89; CN10_22 31.75,-15.89; CN10_23 29.21,-18.43; CN10_24 31.75,-18.43; CN10_25 29.21,-20.97; CN10_26 31.75,-20.97; CN10_27 29.21,-23.51; CN10_28 31.75,-23.51; CN10_29 29.21,-26.05; CN10_30 31.75,-26.05; CN10_31 29.21,-28.59; CN10_32 31.75,-28.59; CN10_33 29.21,-31.13; CN10_34 31.75,-31.13; CN10_35 29.21,-33.67; CN10_36 31.75,-33.67; CN10_37 29.21,-36.21; CN10_38 31.75,-36.21; CN11_1 31.75,37.45; CN11_2 31.75,34.91; CN12_1 -31.75,37.45; CN12_2 -31.75,34.91 | hole 3.05: 24.13,12.05; -24.13,13.32; 8.89,-38.75
3,2 = hole 3.2: 0,0
4POL508 = drill 1.4 long: 1 -7.62,0; 2 -2.54,0; 3 2.54,0; 4 7.62,0

### Placement (x,y rotation side)
C1  186.69,35.56 90 top
C2  43.18,38.1 270 top
C3  152.65,39.62 270 top
C4  99.06,38.1 270 top
C5  21.59,35.56 90 top
C6  78.74,35.56 90 top
C7  132.08,35.56 90 top
D1  166.37,29.21 0 top
D2  157.48,29.21 0 top
D3  147.32,29.21 180 top
D4  138.43,29.21 180 top
D5  172.72,20.32 0 top
D6  161.29,20.32 0 top
D7  146.05,20.32 180 top
D8  133.35,20.79 180 top
D9  113.03,29.21 0 top
D10  104.14,29.21 0 top
D11  93.98,29.21 180 top
D12  85.09,29.21 180 top
D13  120.02,20.83 0 top
D14  108.97,20.7 0 top
D15  91.69,20.7 180 top
D16  78.74,20.57 180 top
D17  57.15,29.21 0 top
D18  48.26,29.21 0 top
D19  38.1,29.21 180 top
D20  29.21,29.21 180 top
D21  64.39,20.57 0 top
D22  52.07,20.57 0 top
D23  35.56,20.32 180 top
D24  22.86,20.32 180 top
DC_DRIVER_01  151.13,58.42 0 top
DC_DRIVER_02  97.79,57.15 0 top
DC_DRIVER_03  41.91,57.15 0 top
ENCODER_1  38.1,91.44 90 top
ENCODER_2  38.1,78.74 90 top
LIMIT_1  38.1,101.6 90 top
LIMIT_2  38.1,109.22 90 top
LIMIT_3  38.1,115.57 90 top
MCP9808-A  152.4,76.2 270 top
MCP9808-B  160.02,82.55 270 top
MOTOR_POWER  185.42,16.51 180 top
PHOTOTRANSISITOR  147.32,116.84 90 top
R1  81.28,106.68 90 top
R2  101.6,90.17 270 top
R3  76.2,101.6 180 top
R4  135.89,127 0 top
R5  124.46,116.84 90 top
SGP30  147.32,97.79 270 top
U1  100.98,104.15 270 top
U$1  [3,2]  20.32,6.35 0 top
U$2  [3,2]  20.32,149.86 0 top
U$3  [3,2]  175.26,6.35 0 top
U$4  [3,2]  189.23,127 0 top
U$5  [3,2]  88.9,95.25 0 top
X1  43.18,6.35 0 top
X2  99.06,6.35 0 top
X3  152.4,7.62 0 top

### Tracks (layer width: path | path; a pad name or v marks a point on that pad's centre or on a via)
3V3
  Top 0.813: 156.21,83.82 152.4,83.82 MCP9808-A.1 | 156.21,83.82 MCP9808-B.2 | 125.73,105.41 115.58,105.41 99.06,121.92 | 99.06,121.92 U1.CN6_4 U1.CN7_16 | 125.73,105.41 128.27,102.87 SGP30.1 150.28,102.87 153.3,99.86 153.3,86.73 156.21,83.82 | 125.73,105.41 124.46,106.68 R5.1 | 81.28,101.6 88.9,101.6 93.98,106.68 | 81.28,101.6 R3.1 | 93.98,106.68 93.98,116.84 99.06,121.92 | R2.1 101.6,99.06 93.98,106.68 | R1.1 81.28,101.6
5V
  Top 1.27: 38.1,64.77 ENCODER_2.1 34.29,74.93 33.02,76.2 33.02,86.36 34.29,87.63 ENCODER_1.1 46.99,87.63 49.56,90.2 49.56,93.22 50.29,93.95 53.31,93.95 71.12,111.76 88.9,111.76 90.17,113.03 U1.CN6_5 U1.CN7_18 | 38.1,64.77 38.1,63.5 36.83,62.23 DC_DRIVER_03.4 | 38.1,64.77 88.9,64.77 | 88.9,64.77 142.24,64.77 146.05,60.96 DC_DRIVER_01.4 | 88.9,64.77 88.9,59.69 90.17,58.42 92.71,58.42 DC_DRIVER_02.4
12V  (via drill 1)
  Top 1.27: D4.1 140.97,29.59 v140.97,33.02 | D1.1 164.21,32.64 v163.83,33.02 | D20.1 31.75,29.59 v31.75,31.75 | D19.1 v43.18,29.21 D18.1 | D17.1 54.61,29.59 v54.61,31.75 | D12.1 87.63,29.59 v87.63,31.75 | D11.1 v99.06,29.21 D10.1 | D9.1 110.49,29.59 v110.49,31.75 | C2.1 v43.18,45.72 | C4.1 v99.06,46.83 | C3.1 152.65,47.62 v152.91,47.88 | D3.1 152.4,29.21 | 152.4,29.21 D2.1 | 152.4,29.21 v152.4,32.77
  Bottom 1.27: v152.91,47.88 152.91,33.27 v152.4,32.77
  pour Bottom (no thermals): 20.95,26.03 207.65,26.03 207.65,33.66 20.95,33.66
  pour Top (no thermals): 152.02,48.52 153.03,47.51 153.03,51.68 152.77,51.94 152.02,51.94
  pour Bottom: 152.12,47.05 152.15,46.93 152.15,34.29 153.41,34.29 153.67,34.55 153.67,48 153.53,48.13 151.9,48.13 151.76,48 151.76,47.51 152,47.27 152.07,47.16
  pour Top (no thermals): 98.43,46.48 99.57,46.48 99.57,51.44 98.42,51.44 98.42,46.49
  pour Bottom: 98.43,32 99.69,32 99.69,47.12 98.42,47.12 98.42,32.01
  pour Top (no thermals): 42.63,45.03 43.6,45.03 44.25,45.68 44.25,50.97 43.98,51.23 42.63,51.23 42.11,50.72 42.11,45.55
  pour Bottom: 42.12,32.33 43.35,32.33 44.25,33.23 44.25,46.65 43.73,47.17 42.88,47.17 42.11,46.4 42.11,32.34
  pour Bottom (no thermals): 185.62,12.9 190.3,12.9 190.3,26.47 185.62,26.47
DC_1A  (via drill 0.5)
  Top 0.406: U1.CN9_8 U1.CN10_23 81.28,73.67 v81.28,69.85 | DC_DRIVER_02.5 v93.98,43.18 | v81.28,41.91 80.01,43.18 v80.01,59.69
  Bottom 0.406: v93.98,43.18 92.71,41.91 v81.28,41.91 | v80.01,59.69 80.01,68.58 v81.28,69.85
DC_1B  (via drill 0.5)
  Top 0.406: U1.CN10_21 86.61,76.46 U1.CN5_1 | DC_DRIVER_02.7 96.52,43.18 v93.98,40.64 | v77.47,40.64 58.42,59.69 v55.88,59.69 | v55.88,69.85 55.88,73.66 v64.77,82.55
  Bottom 0.406: v93.98,40.64 v77.47,40.64 | v55.88,59.69 v55.88,69.85 | v64.77,82.55 84.08,82.55 U1.CN5_1
DC_2A  (via drill 0.5)
  Top 0.406: U1.CN10_33 69.85,77.47 | 69.85,77.47 U1.CN9_3 | v91.44,59.69 99.06,59.69 100.08,58.67 100.08,54.86 DC_DRIVER_02.10 | v78.74,55.88 63.5,55.88 v59.69,59.69 | v59.69,67.31 59.69,73.66 63.5,77.47 69.85,77.47
  Bottom 0.406: v91.44,59.69 82.55,59.69 v78.74,55.88 | v59.69,59.69 v59.69,67.31
DC_2B  (via drill 0.5)
  Top 0.406: DC_DRIVER_02.12 102.87,58.42 v105.41,60.96 | v105.41,68.58 104.14,67.31 97.79,67.31 95.25,69.85 U1.CN10_14
  Bottom 0.406: v105.41,60.96 v105.41,68.58
DC_3A  (via drill 0.5)
  Top 0.406: U1.CN5_6 99.31,76.46 U1.CN10_11 95.26,77.47 93.98,76.19 v93.98,66.88 | v85.09,60.96 42.82,60.96 42.16,60.96 41.53,60.96 v39.62,62.86 | v31.69,64.45 31.69,60.9 24.13,53.34 24.13,46.99 v25.4,45.72 | v38.1,45.72 DC_DRIVER_03.5
  Bottom 0.406: v85.09,60.96 91.01,66.88 v93.98,66.88 | v39.62,62.86 36.7,65.79 32.89,65.79 31.62,64.52 v31.69,64.45 | v25.4,45.72 v38.1,45.72
DC_3B  (via drill 0.5)
  Top 0.406: U1.CN10_31 U1.CN9_4 72.39,81.28 69.85,83.82 48.26,83.82 41.91,77.47 v41.91,67.31 | DC_DRIVER_03.7 40.64,45.72 v38.1,43.18 | v22.86,44.45 22.86,59.69 v30.48,67.31
  Bottom 0.406: v38.1,43.18 24.13,43.18 v22.86,44.45 | v30.48,67.31 v41.91,67.31
DC_4A  (via drill 0.5)
  Top 0.406: U1.CN9_7 U1.CN10_25 78.74,73.67 78.74,69.85 73.66,69.85 v69.85,66.04
  Bottom 0.406: v69.85,66.04 55.88,52.07 44.45,52.07 DC_DRIVER_03.10
DC_4B  (via drill 0.5)
  Top 0.406: v74.93,67.31 86.36,67.31 90.17,71.12 U1.CN10_18
  Bottom 0.406: v74.93,67.31 67.31,67.31 67.31,64.77 58.04,55.5 51.32,55.5 51.32,57.14 50.29,58.17 48.51,58.17 46.99,56.64 DC_DRIVER_03.12
DC_EN_1  (via drill 0.5)
  Top 0.406: v125.73,87.63 102.87,110.49 v102.87,115.57 | v106.68,118.11 106.68,127 114.3,134.62 114.3,137.16 113.03,138.43 97.78,138.43 U1.CN7_13
  Bottom 0.406: DC_DRIVER_02.6 95.25,57.15 97.79,59.69 125.73,59.69 v125.73,87.63 | v102.87,115.57 105.41,118.11 v106.68,118.11
DC_EN_2  (via drill 0.5)
  Top 0.406: v101.47,66.04 113.03,66.04 v120.65,73.66 | v119.38,82.55 99.06,102.87 v99.06,118.11 | v102.87,121.92 102.87,129.54 101.6,130.81 93.98,130.81 93.97,130.82 93.97,134.93 93.01,135.9 U1.CN7_15 | DC_DRIVER_02.11 101.85,49.28 v101.85,43.43 | v115.82,47.75 115.82,52.07 107.95,59.94 107.95,61.98 107.7,62.23 v101.6,62.23
  Bottom 0.406: v120.65,73.66 119.38,74.93 v119.38,82.55 | v99.06,118.11 v102.87,121.92 | v101.47,66.04 101.6,65.91 v101.6,62.23 | v101.85,43.43 112.27,43.43 115.82,46.99 v115.82,47.75
DC_EN_3  (via drill 0.5)
  Top 0.406: DC_DRIVER_03.6 v39.37,59.69 | v35.56,63.5 29.21,69.85 29.21,119.38 52.07,142.24 76.21,142.24 U1.CN7_23
  Bottom 0.406: v39.37,59.69 v35.56,63.5
DC_EN_4  (via drill 0.5)
  Top 0.406: v45.72,67.31 45.72,80.01 v48.26,82.55 | v48.26,91.44 48.26,124.46 63.5,139.7 76.21,139.7 U1.CN7_25 | DC_DRIVER_03.11 45.72,43.43 v46.48,42.67 | v60.96,44.96 59.94,45.97 59.94,54.1 55.63,58.42 52.83,58.42 51.56,59.69 v45.72,59.69
  Bottom 0.406: v45.72,67.31 v45.72,59.69 | v48.26,82.55 v48.26,91.44 | v46.48,42.67 58.67,42.67 v60.96,44.96
ENC_1A  (via drill 0.5)
  Top 0.406: U1.CN10_17 90.17,78.5 U1.CN5_3 | v91.44,86.36 62.23,86.36 v60.96,87.63 | v58.42,88.9 55.88,91.44 55.88,92.71 v50.8,92.71
  Bottom 0.406: U1.CN5_3 91.44,80.27 v91.44,86.36 | v60.96,87.63 59.69,87.63 v58.42,88.9 | v50.8,92.71 ENCODER_1.3
ENC_1B  (via drill 0.5)
  Top 0.406: v24.13,95.25 24.13,120.65 52.07,148.59 v81.28,148.59
  Bottom 0.406: ENCODER_1.4 v24.13,95.25 | v81.28,148.59 85.09,144.78 U1.CN7_21
ENC_2A  (via drill 0.5)
  Top 0.406: v26.67,80.01 26.67,120.65 v33.02,127 | v40.64,127 43.18,127 v46.99,123.19 | v49.53,121.92 76.2,121.92 v77.47,123.19 | U1.CN7_28 U1.CN8_1
  Bottom 0.406: ENCODER_2.3 v26.67,80.01 | v33.02,127 v40.64,127 | v46.99,123.19 48.26,123.19 v49.53,121.92 | v77.47,123.19 U1.CN8_1
ENC_2B  (via drill 0.5)
  Top 0.406: U1.CN8_2 U1.CN7_30 | v31.75,91.44 31.75,119.38 34.29,121.92 41.91,121.92 v45.72,118.11 | v50.8,118.11 73.66,118.11 v74.93,119.38
  Bottom 0.406: ENCODER_2.4 31.75,88.9 v31.75,91.44 | v45.72,118.11 v50.8,118.11 | v74.93,119.38 U1.CN8_2
GND  (via drill 1)
  Top 1.27: D21.2 v71.63,20.57 D16.2 | D22.2 v57.4,20.57 | D23.2 v30.48,20.32 | D24.2 v17.78,20.32 | D15.2 v86.61,20.7 86.49,20.7 | D14.2 v114.17,20.7 114.3,20.7 | D13.2 v126.75,20.83 131.15,20.83 D8.2 | D7.2 v140.97,20.32 | D6.2 v166.37,20.32 | D5.2 v177.8,20.32 | C2.2 40.24,37.23 v39.37,38.1 | C4.2 98.67,36.83 v95.25,36.83 | C3.2 150.74,36.83 v148.59,36.83
  pour Bottom (isolate 0.61, rank 6, no thermals): -13.67,182.32 -13.78,182.27 -13.91,182.24 -14.61,182.24 -14.61,-6.09 15.5,-36.2 260.09,-36.2 300.36,4.07 300.36,153.41 270.25,183.51 -12.44,183.51 -13.57,182.39
IN_LIMIT1  (via drill 0.5)
  Top 0.406: R3.2 63.3,90.17 62.23,90.17 v57.15,85.09 | v60.96,71.12 62.23,69.85 68.58,69.85 69.85,71.12 U1.CN10_34
  Top 0.813: R3.2 v64.77,101.6 | v45.72,101.6 44.45,100.33 LIMIT_1.1
  Bottom 0.406: v57.15,85.09 60.96,81.28 v60.96,71.12
  Bottom 0.813: v64.77,101.6 v45.72,101.6
IN_LIMIT2  (via drill 0.5)
  Top 0.406: v101.6,86.36 R2.2 78.94,88.7 v71.12,96.52 | v54.61,97.79 50.8,101.6 v50.8,107.95
  Bottom 0.406: U1.CN10_6 104.14,73.67 104.14,76.2 105.62,77.68 105.62,82.34 v101.6,86.36 | v54.61,97.79 55.88,96.52 59.61,96.52 61.09,98 63.37,98 64.85,96.52 v71.12,96.52 | v50.8,107.95 LIMIT_2.1
IN_LIMIT3  (via drill 0.5)
  Top 0.406: R1.2 78.94,110.49 v76.2,110.49 | v76.2,114.3 v49.53,114.3 | v46.99,114.3 LIMIT_3.1
  Bottom 0.406: v76.2,110.49 v76.2,114.3 97.79,114.3 105.41,121.92 110.49,121.92 110.49,130.81 106.68,130.81 106.68,134.63 U1.CN7_3 | v49.53,114.3 v46.99,114.3
IN_REFL  (via drill 0.5)
  Top 0.406: U1.CN7_32 U1.CN8_3 72.39,125.73 73.66,124.46 v87.63,124.46 | v107.95,124.46 117.77,124.46 120.52,121.7 R5.2 135.4,117.76 138.84,121.19 146.78,121.19 PHOTOTRANSISITOR.4
  Bottom 0.406: v87.63,124.46 v107.95,124.46
N$1
  Top 0.406: R4.2 146.19,127 150.75,122.44 150.75,115.05 150.01,114.31 149.87,114.31 148.59,113.03 PHOTOTRANSISITOR.1
OUT1
  pour Top (no thermals): 89.51,6.54 89.53,6.41 89.53,4.07 90.17,3.44 92.08,5.34 92.08,7.36 83.33,16.11 83.26,16.21 83.21,16.32 83.19,16.45 83.19,25.46 83.21,25.59 83.26,25.7 83.33,25.8 84.45,26.93 84.45,31.81 84.48,31.94 84.53,32.05 84.6,32.15 85.72,33.28 85.72,52.13 85.75,52.26 85.8,52.37 85.87,52.47 85.96,52.56 86.06,52.63 86.17,52.68 86.3,52.7 90.81,52.7 90.81,56.52 87.89,56.52 83.19,51.81 83.19,35.5 83.16,35.37 83.11,35.26 83.04,35.16 81.92,34.03 81.92,30.42 81.89,30.29 81.84,30.18 81.77,30.08 80.64,28.95 80.64,15.5 89.39,6.75 89.46,6.65
OUT2
  pour Top (no thermals): 95.23,18.35 95.25,18.22 95.25,5.6 96.65,4.2 97.92,5.47 97.92,9.64 96.92,10.64 96.85,10.75 96.8,10.86 96.77,10.99 96.77,19.29 92.85,23.22 92.78,23.32 92.73,23.44 92.71,23.56 92.71,30.98 92.09,31.6 92.02,31.7 91.97,31.82 91.95,31.94 91.95,50.92 91.81,51.05 91.2,51.05 90.81,50.66 90.81,49.79 90.86,49.7 90.91,49.59 90.93,49.47 90.93,23.89 91.93,22.88 92,22.78 92.05,22.66 92.08,22.54 92.08,21.6 95.11,18.57 95.18,18.46
OUT3
  pour Top (no thermals): 103.43,11.13 103.36,11.03 100.97,8.63 100.97,4.07 101.86,3.18 103.5,3.18 103.5,8.95 103.53,9.08 103.58,9.19 103.65,9.29 106.05,11.69 106.05,16.57 106.07,16.7 106.12,16.81 106.19,16.91 107.31,18.04 107.31,34.03 104.92,36.43 104.85,36.53 104.8,36.64 104.78,36.77 104.78,51.44 103.5,51.44 103.5,34.55 105.9,32.15 105.97,32.05 106.02,31.94 106.05,31.81 106.05,21.53 106.02,21.4 105.97,21.29 105.9,21.19 103.5,18.79 103.5,11.37 103.48,11.24
OUT4
  pour Top (no thermals): 106.98,7.06 106.87,7.01 106.74,6.98 106.05,6.98 106.05,4.45 107.69,4.45 118.75,15.5 118.75,25.14 117.62,26.27 117.55,26.37 117.5,26.48 117.47,26.61 117.47,27.68 115.08,30.08 115.01,30.18 114.96,30.29 114.94,30.42 114.94,45.46 113.81,46.59 113.74,46.69 113.69,46.8 113.67,46.93 113.67,51.81 108.96,56.52 104.78,56.52 104.78,53.98 109.28,53.98 109.41,53.95 109.52,53.9 109.62,53.83 112.25,51.2 112.32,51.1 112.37,50.99 112.39,50.86 112.39,45.98 113.52,44.85 113.59,44.75 113.64,44.64 113.67,44.51 113.67,28.2 114.79,27.07 114.86,26.97 114.91,26.86 114.94,26.73 114.94,24.39 116.06,23.26 116.13,23.16 116.18,23.05 116.2,22.92 116.2,15.18 116.18,15.05 116.13,14.94 116.06,14.84 109.62,8.4 109.52,8.33 109.41,8.28 109.28,8.26 108.21,8.26 107.08,7.13
OUT5
  pour Top (no thermals): 33.63,6.54 33.66,6.41 33.66,4.07 34.29,3.44 36.2,5.34 36.2,7.36 27.45,16.11 27.38,16.21 27.33,16.32 27.3,16.45 27.3,25.46 27.33,25.59 27.38,25.7 27.45,25.8 28.57,26.93 28.57,31.81 28.6,31.94 28.65,32.05 28.72,32.15 29.84,33.28 29.84,52.13 29.87,52.26 29.92,52.37 29.99,52.47 30.08,52.56 30.18,52.63 30.29,52.68 30.42,52.7 34.92,52.7 34.92,56.52 32.01,56.52 27.3,51.81 27.3,35.5 27.28,35.37 27.23,35.26 27.16,35.16 26.04,34.03 26.04,30.42 26.01,30.29 25.96,30.18 25.89,30.08 24.77,28.95 24.77,15.5 33.51,6.75 33.58,6.65
OUT6
  pour Top (no thermals): 39.35,18.35 39.37,18.22 39.37,5.6 40.77,4.2 42.04,5.47 42.04,9.64 41.04,10.64 40.97,10.75 40.92,10.86 40.89,10.99 40.89,19.29 36.97,23.22 36.9,23.32 36.85,23.44 36.83,23.56 36.83,30.98 36.21,31.6 36.14,31.7 36.09,31.82 36.07,31.94 36.07,50.92 35.93,51.05 35.32,51.05 34.92,50.66 34.92,49.79 34.98,49.7 35.03,49.59 35.05,49.47 35.05,23.89 36.05,22.88 36.12,22.78 36.17,22.66 36.2,22.54 36.2,21.6 39.23,18.57 39.3,18.46
OUT7
  pour Top (no thermals): 47.55,11.13 47.48,11.03 45.09,8.63 45.09,4.07 45.98,3.18 47.62,3.18 47.62,8.95 47.65,9.08 47.7,9.19 47.77,9.29 50.16,11.69 50.16,16.57 50.19,16.7 50.24,16.81 50.31,16.91 51.44,18.04 51.44,34.03 49.04,36.43 48.97,36.53 48.92,36.64 48.9,36.77 48.9,51.44 47.62,51.44 47.62,34.55 50.02,32.15 50.09,32.05 50.14,31.94 50.16,31.81 50.16,21.53 50.14,21.4 50.09,21.29 50.02,21.19 47.62,18.79 47.62,11.37 47.6,11.24
OUT8
  pour Top (no thermals): 51.1,7.06 50.99,7.01 50.86,6.98 50.16,6.98 50.16,4.45 51.81,4.45 62.87,15.5 62.87,25.14 61.74,26.27 61.67,26.37 61.62,26.48 61.59,26.61 61.59,27.68 59.2,30.08 59.13,30.18 59.08,30.29 59.05,30.42 59.05,45.46 57.93,46.59 57.86,46.69 57.81,46.8 57.78,46.93 57.78,51.81 53.08,56.52 48.9,56.52 48.9,53.98 53.4,53.98 53.53,53.95 53.64,53.9 53.74,53.83 56.37,51.2 56.44,51.1 56.49,50.99 56.52,50.86 56.52,45.98 57.64,44.85 57.71,44.75 57.76,44.64 57.78,44.51 57.78,28.2 58.91,27.07 58.98,26.97 59.03,26.86 59.05,26.73 59.05,24.39 60.18,23.26 60.25,23.16 60.3,23.05 60.33,22.92 60.33,15.18 60.3,15.05 60.25,14.94 60.18,14.84 53.74,8.4 53.64,8.33 53.53,8.28 53.4,8.26 52.33,8.26 51.2,7.13
OUT9
  pour Top (no thermals): 142.85,7.81 142.88,7.68 142.88,5.34 143.51,4.71 145.41,6.61 145.41,9.9 136.67,18.65 136.6,18.75 136.55,18.86 136.53,18.99 136.53,26.73 136.55,26.86 136.6,26.97 136.67,27.07 137.79,28.2 137.79,33.08 137.82,33.21 137.87,33.32 137.94,33.42 139.06,34.55 139.06,53.4 139.09,53.53 139.14,53.64 139.21,53.74 139.3,53.83 139.4,53.9 139.51,53.95 139.64,53.98 144.15,53.98 144.15,57.79 141.23,57.79 136.53,53.08 136.53,36.77 136.5,36.64 136.45,36.53 136.38,36.43 135.25,35.3 135.25,31.69 135.23,31.56 135.18,31.45 135.11,31.35 133.99,30.22 133.99,16.77 142.73,8.02 142.8,7.92
OUT10
  pour Top (no thermals): 148.57,19.62 148.59,19.49 148.59,6.87 149.99,5.47 151.26,6.74 151.26,10.91 150.26,11.91 150.19,12.02 150.14,12.13 150.11,12.26 150.11,20.56 146.19,24.49 146.12,24.59 146.07,24.71 146.05,24.83 146.05,32.25 145.43,32.87 145.36,32.97 145.31,33.09 145.29,33.21 145.29,52.19 145.15,52.32 144.54,52.32 144.15,51.93 144.15,51.06 144.2,50.97 144.25,50.86 144.27,50.74 144.27,25.16 145.27,24.15 145.34,24.05 145.39,23.93 145.41,23.81 145.41,22.87 148.45,19.84 148.52,19.73
OUT11
  pour Top (no thermals): 156.77,12.4 156.7,12.3 154.31,9.9 154.31,5.34 155.2,4.45 156.84,4.45 156.84,10.22 156.87,10.35 156.92,10.46 156.99,10.56 159.38,12.96 159.38,17.84 159.41,17.97 159.46,18.08 159.53,18.18 160.66,19.31 160.66,35.3 158.26,37.7 158.19,37.8 158.14,37.91 158.12,38.04 158.12,52.7 156.84,52.7 156.84,35.82 159.24,33.42 159.31,33.32 159.36,33.21 159.38,33.08 159.38,22.8 159.36,22.67 159.31,22.56 159.24,22.46 156.84,20.06 156.84,12.64 156.82,12.51
OUT12
  pour Top (no thermals): 160.32,8.33 160.21,8.28 160.08,8.26 159.38,8.26 159.38,5.71 161.03,5.71 172.09,16.77 172.09,26.41 170.96,27.54 170.89,27.64 170.84,27.75 170.81,27.88 170.81,28.95 168.42,31.35 168.35,31.45 168.3,31.56 168.28,31.69 168.28,46.73 167.15,47.86 167.08,47.96 167.03,48.07 167,48.2 167,53.08 162.3,57.79 158.12,57.79 158.12,55.25 162.62,55.25 162.75,55.22 162.86,55.17 162.96,55.1 165.59,52.47 165.66,52.37 165.71,52.26 165.74,52.13 165.74,47.25 166.86,46.12 166.93,46.02 166.98,45.91 167,45.78 167,29.47 168.13,28.34 168.2,28.24 168.25,28.13 168.28,28 168.28,25.66 169.4,24.53 169.47,24.43 169.52,24.32 169.54,24.19 169.54,16.45 169.52,16.32 169.47,16.21 169.4,16.11 162.96,9.67 162.86,9.6 162.75,9.55 162.62,9.53 161.55,9.53 160.42,8.4
OUT_REFL  (via drill 0.5)
  Top 0.406: R4.1 125.73,127 v116.84,135.89
  Bottom 0.406: v116.84,135.89 U1.CN7_1
SDA
  Top 0.406: 129.54,81.28 115.65,81.28 114.17,82.76 111.89,82.76 110.41,81.28 108.19,81.28 U1.CN5_9 106.93,76.46 U1.CN10_5 | SGP30.5 129.54,92.71 129.54,81.28 | 129.54,81.28 129.54,78.61 131.62,76.53 131.62,74.93 135.38,71.17 138.94,71.17 139.66,71.89 139.66,72.06 139.99,72.39 MCP9808-A.4
SLC  (via drill 0.5)
  Top 0.406: 138.43,78.74 132.08,85.09 132.08,90.17 148.73,90.17 151.9,93.34 150,95.25 SGP30.4 | 109.22,76.21 U1.CN10_3 | 109.22,76.21 109.22,79.77 U1.CN5_10 | MCP9808-A.3 142.13,74.93 138.43,78.63 138.43,78.74 | 109.22,76.21 v130.8,76.21 v130.81,76.2 | v133.35,76.2 135.89,78.74 138.43,78.74
  Bottom 0.406: v130.81,76.2 v133.35,76.2
STEP_1A  (via drill 0.5)
  Top 0.406: U1.CN10_27 U1.CN9_6 77.47,81.28 78.74,82.55 110.89,82.55 111.66,83.32 112.53,83.32 v114.3,85.09 | DC_DRIVER_01.5 v147.32,44.45 | v134.62,44.45 132.08,46.99 v132.08,63.5 | v132.08,68.12 128.27,71.93 128.27,74.83 v128.17,74.93
  Bottom 0.406: v147.32,44.45 v134.62,44.45 | v114.3,85.09 120.65,91.44 125.73,91.44 127,90.17 127,76.2 128.17,75.03 v128.17,74.93 | v132.08,63.5 v132.08,68.12
STEP_1B  (via drill 0.5)
  Top 0.406: U1.CN10_29 U1.CN9_5 74.93,82.55 77.47,85.09 109.22,85.09 v111.76,87.63 | DC_DRIVER_01.7 149.86,44.45 v147.32,41.91 | v134.62,40.64 123.19,52.07 v123.19,62.23 | v120.65,88.9 119.38,90.17 v114.3,90.17
  Bottom 0.406: v147.32,41.91 146.05,40.64 v134.62,40.64 | v123.19,62.23 123.19,86.36 v120.65,88.9 | v114.3,90.17 v111.76,87.63
STEP_1C  (via drill 0.5)
  Top 0.406: U1.CN8_4 U1.CN7_34 | DC_DRIVER_01.10 v153.67,59.69 | v151.13,62.23 175.26,86.36 175.26,144.78 v80.01,144.78
  Bottom 0.406: v153.67,59.69 v151.13,62.23 | v80.01,144.78 77.47,144.78 76.2,146.05 69.22,139.06 69.22,138.27 71.14,136.35 71.14,133.35 U1.CN7_34
STEP_1D  (via drill 0.5)
  Top 0.406: DC_DRIVER_01.12 v156.21,60.96 | v149.86,67.31 119.38,67.31 v118.11,68.58 | v113.03,69.85 106.55,69.85 106.05,70.36 100.84,70.36 v98.93,68.45 | v87,70.1 84.58,70.1 82.55,72.14 U1.CN10_24
  Bottom 0.406: v156.21,60.96 v149.86,67.31 | v118.11,68.58 114.3,68.58 v113.03,69.85 | v87,70.1 89.41,67.69 98.17,67.69 v98.93,68.45
STEP_EN_1  (via drill 0.5)
  Top 0.406: DC_DRIVER_01.11 v154.94,44.45 | v165.1,57.15 160.02,62.23 | 160.02,62.23 153.67,62.23 148.59,57.15 DC_DRIVER_01.6 | 160.02,62.23 179.07,62.23 179.07,146.05 77.47,146.05 76.2,144.78 v76.2,143.51
  Bottom 0.406: v154.94,44.45 156.21,45.72 162.56,45.72 165.1,48.26 v165.1,57.15 | v76.2,143.51 77.47,142.24 U1.CN7_27

### Text on the board
tPlace: IN_REFL1 | GND | GND | IN_LIMIT3 | GND | GND | OUT_REF; | IN_LIMIT2 | GND | 3V3 | IN_LIMIT1 | GND | GND | ENC_2B | SLC | ENC_1A | SDA | GND | 5v | GND | 3V3 | ENC_2B | 3V3 | GND | ENC_2A | GND | GND | GND | 5V | SLC | SDA | 12V | Out10 | GND | Out6 | Out7 | Out2 | Out9 | Out1 | Out4 | Out8 | Out11 | Out3 | Out5 | Out12